# Altium project FLEXI_HAL_2000.PrjPCB (part 2 of 3)

## Sheet Stepper_driver_group.SchDoc: STM32F446 CNC
size C; Author: AM; CompanyName: Expatria Technologies; DrawnBy: A.Marles; Engineer: AM; Organization: Expatria Technologies; DocumentNumber: 4; Revision: A7; SheetNumber: 4; SheetTotal: 14
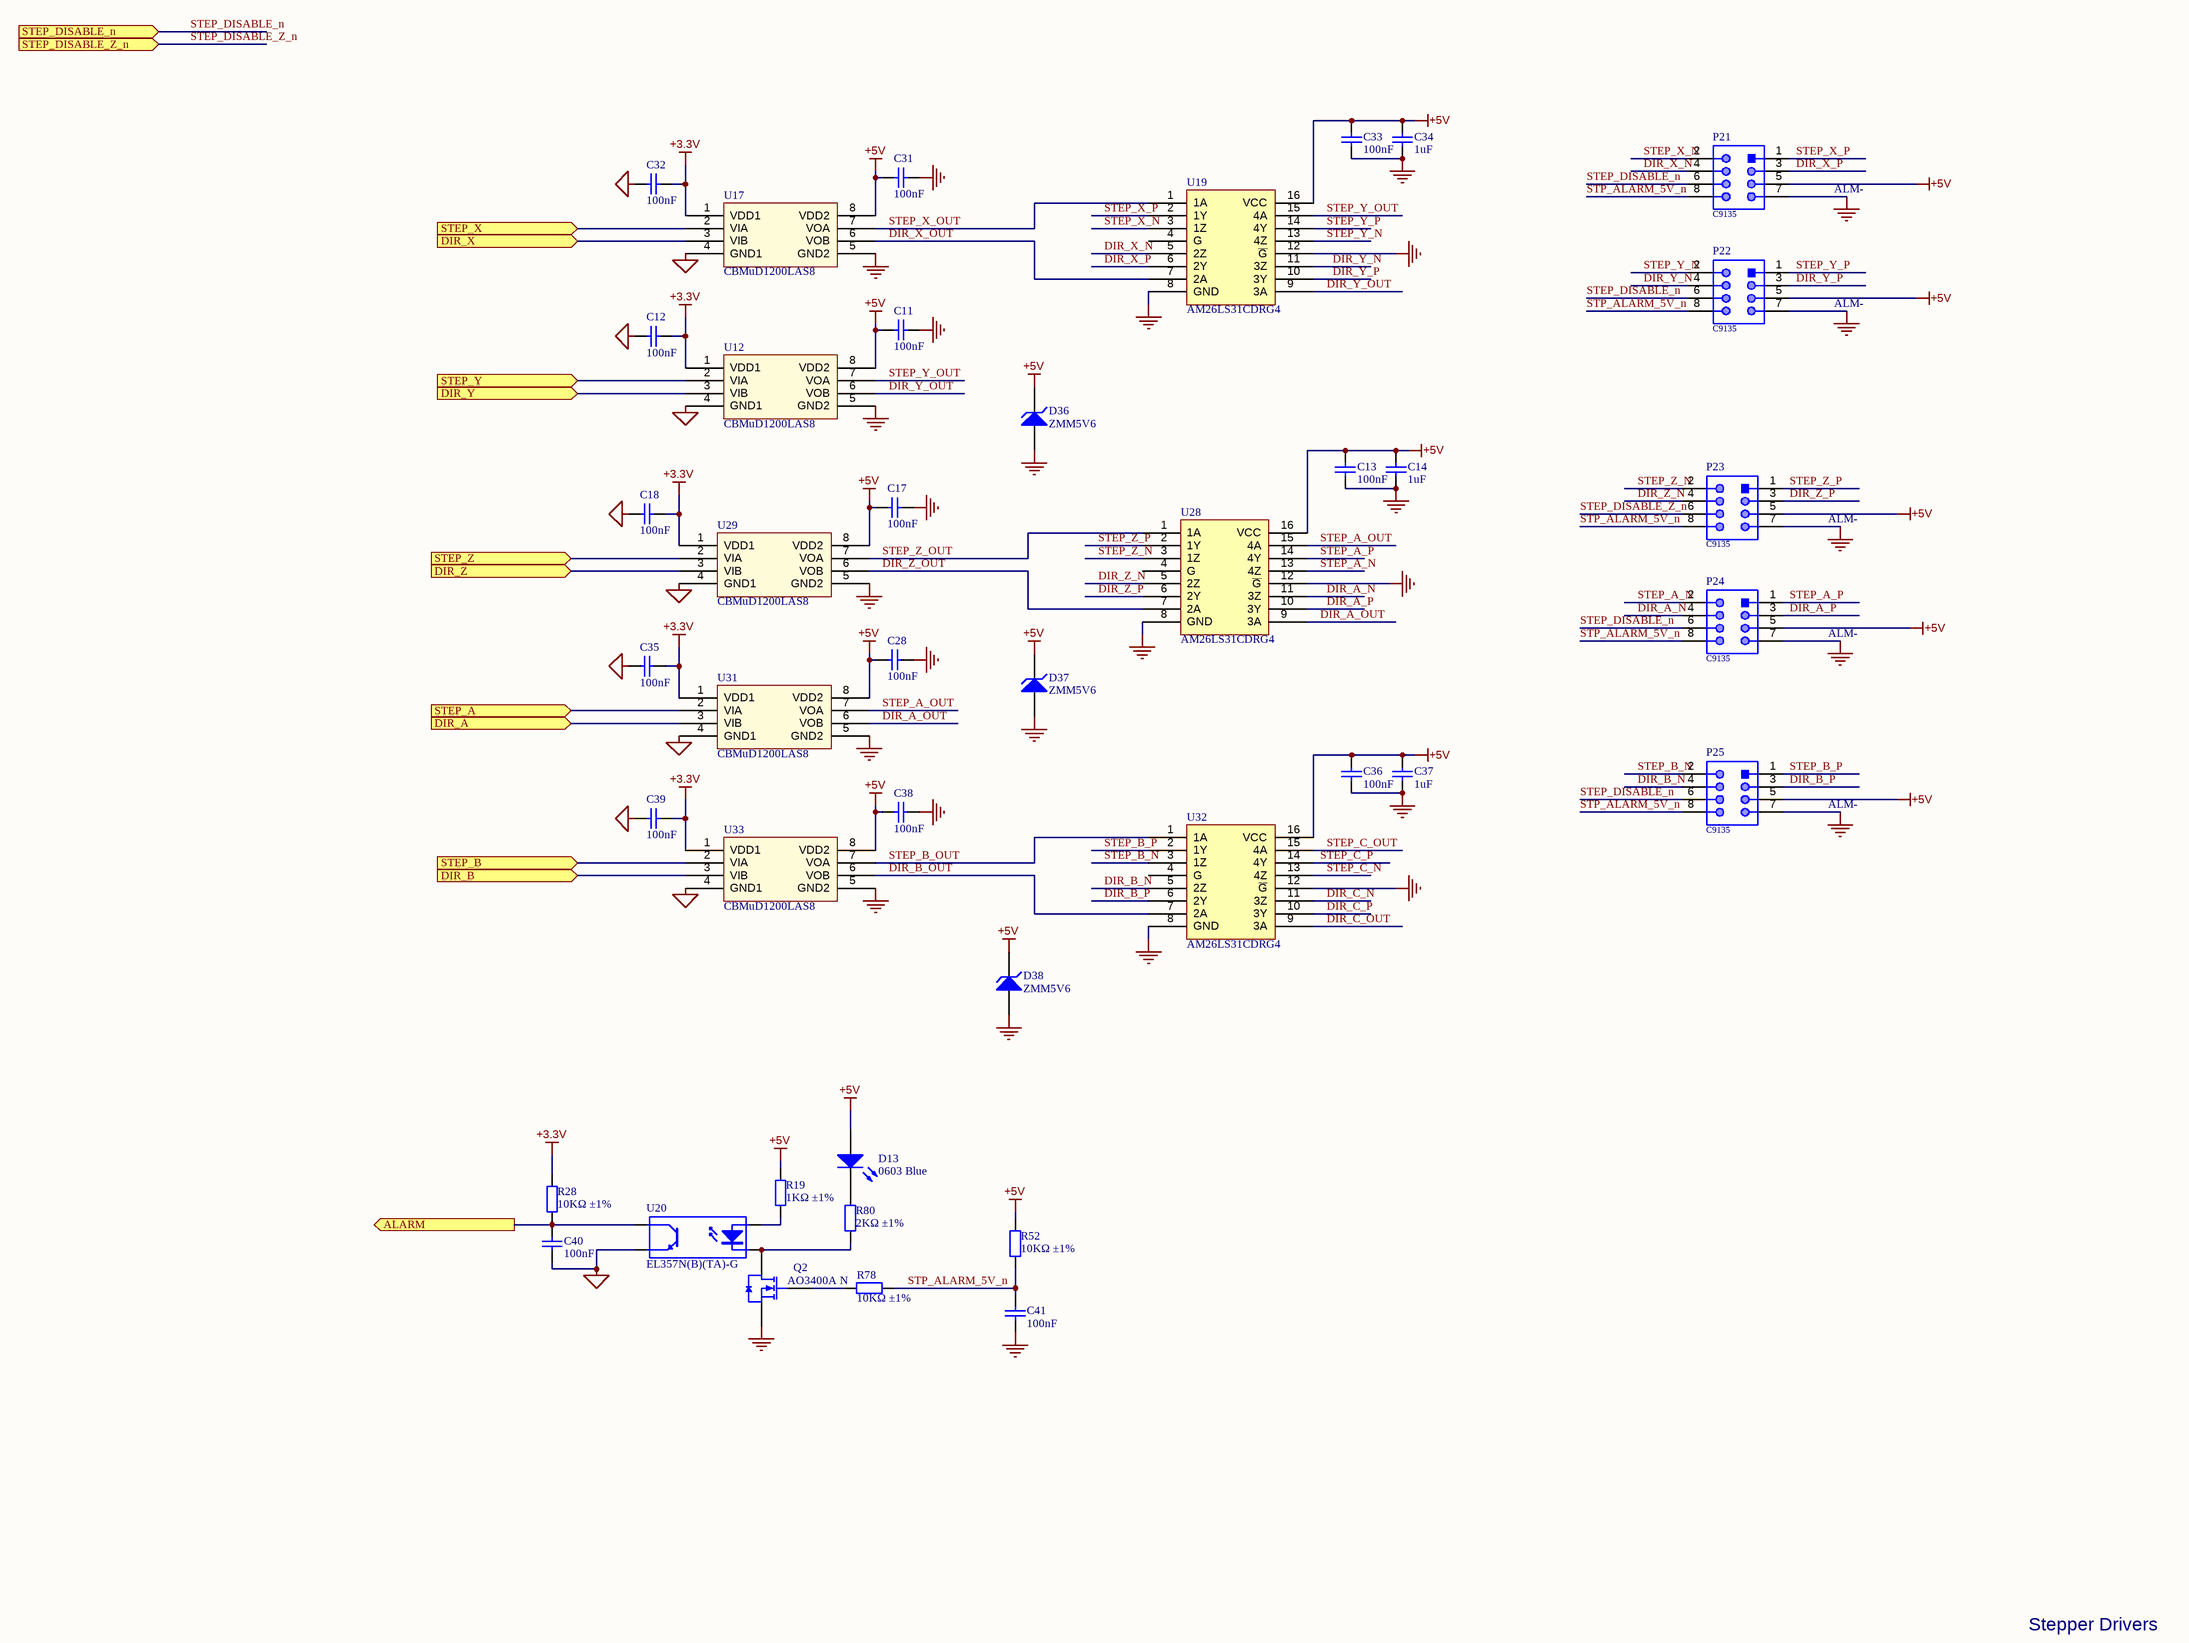
[diagram p7: Stepper_driver_group.SchDoc]

### Parts
C11  100nF  [0603_C]
C12  100nF  [0603_C]
C13  100nF  [0603_C]
C14  1uF  [0603_C]
C17  100nF  [0603_C]
C18  100nF  [0603_C]
C28  100nF  [0603_C]
C31  100nF  [0603_C]
C32  100nF  [0603_C]
C33  100nF  [0603_C]
C34  1uF  [0603_C]
C35  100nF  [0603_C]
C36  100nF  [0603_C]
C37  1uF  [0603_C]
C38  100nF  [0603_C]
C39  100nF  [0603_C]
C40  100nF  [0603_C]
C41  100nF  [0603_C]
D13  0603 Blue  [0603_LED_S1]
D36  ZMM5V6  [LL-34]
D37  ZMM5V6  [LL-34]
D38  ZMM5V6  [LL-34]
P21  C9135  [61200821621]
P22  C9135  [61200821621]
P23  C9135  [61200821621]
P24  C9135  [61200821621]
P25  C9135  [61200821621]
Q2  AO3400A N  [SOT-23-3L]
R19  1KΩ ±1%  [0603_R]
R28  10KΩ ±1%  [0603_R]
R52  10KΩ ±1%  [0603_R]
R78  10KΩ ±1%  [0603_R]
R80  2KΩ ±1%  [0603_R]
U12  CBMuD1200LAS8  [SOIC-8_150mil]
U17  CBMuD1200LAS8  [SOIC-8_150mil]
U19  AM26LS31CDRG4  [SOIC-16_150mil]
U20  EL357N(B)(TA)-G  [SOP-4_P2.54]
U28  AM26LS31CDRG4  [SOIC-16_150mil]
U29  CBMuD1200LAS8  [SOIC-8_150mil]
U31  CBMuD1200LAS8  [SOIC-8_150mil]
U32  AM26LS31CDRG4  [SOIC-16_150mil]
U33  CBMuD1200LAS8  [SOIC-8_150mil]

### Ports
ALARM (out), DIR_A (in), DIR_B (in), DIR_X (in), DIR_Y (in), DIR_Z (in), STEP_A (in), STEP_B (in), STEP_DISABLE_n (in), STEP_DISABLE_Z_n (in), STEP_X (in), STEP_Y (in), STEP_Z (in)

### Nets
+3.3V: C12.1 C18.1 C32.1 C35.1 C39.1 R28.2 U12.1(VDD1) U17.1(VDD1) U29.1(VDD1) U31.1(VDD1) U33.1(VDD1)
+5V: C11.2 C13.1 C14.1 C17.2 C28.2 C31.2 C33.1 C34.1 C36.1 C37.1 C38.2 D13.A D36.2(K) D37.2(K) D38.2(K) P21.5 P22.5 P23.5 P24.5 P25.5 R19.1 R52.2 U12.8(VDD2) U17.8(VDD2) U19.16(VCC) U28.16(VCC) U29.8(VDD2) U31.8(VDD2) U32.16(VCC) U33.8(VDD2)
GND: C11.1 C13.2 C14.2 C17.1 C28.1 C31.1 C33.2 C34.2 C36.2 C37.2 C38.1 C41.1 D36.1(A) D37.1(A) D38.1(A) P21.7 P22.7 P23.7 P24.7 P25.7 Q2.2(S) U12.5(GND2) U17.5(GND2) U19.8(GND) U19.12(~{G}) U28.8(GND) U28.12(~{G}) U29.5(GND2) U31.5(GND2) U32.8(GND) U32.12(~{G}) U33.5(GND2)
MCU_GND: C12.2 C18.2 C32.2 C35.2 C39.2 C40.1 U12.4(GND1) U17.4(GND1) U20.3(E) U29.4(GND1) U31.4(GND1) U33.4(GND1)
DIR_A: U31.3(VIB) ; port DIR_A
DIR_A_N: P24.4 U28.11(3Z)
DIR_A_OUT: U28.9(3A) U31.6(VOB)
DIR_A_P: P24.3 U28.10(3Y)
DIR_B: U33.3(VIB) ; port DIR_B
DIR_B_N: P25.4 U32.5(2Z)
DIR_B_OUT: U32.7(2A) U33.6(VOB)
DIR_B_P: P25.3 U32.6(2Y)
DIR_C_N: U32.11(3Z)
DIR_C_OUT: U32.9(3A)
DIR_C_P: U32.10(3Y)
DIR_X: U17.3(VIB) ; port DIR_X
DIR_X_N: P21.4 U19.5(2Z)
DIR_X_OUT: U17.6(VOB) U19.7(2A)
DIR_X_P: P21.3 U19.6(2Y)
DIR_Y: U12.3(VIB) ; port DIR_Y
DIR_Y_N: P22.4 U19.11(3Z)
DIR_Y_OUT: U12.6(VOB) U19.9(3A)
DIR_Y_P: P22.3 U19.10(3Y)
DIR_Z: U29.3(VIB) ; port DIR_Z
DIR_Z_N: P23.4 U28.5(2Z)
DIR_Z_OUT: U28.7(2A) U29.6(VOB)
DIR_Z_P: P23.3 U28.6(2Y)
STEP_A: U31.2(VIA) ; port STEP_A
STEP_A_N: P24.2 U28.13(4Z)
STEP_A_OUT: U28.15(4A) U31.7(VOA)
STEP_A_P: P24.1 U28.14(4Y)
STEP_B: U33.2(VIA) ; port STEP_B
STEP_B_N: P25.2 U32.3(1Z)
STEP_B_OUT: U32.1(1A) U33.7(VOA)
STEP_B_P: P25.1 U32.2(1Y)
STEP_C_N: U32.13(4Z)
STEP_C_OUT: U32.15(4A)
STEP_C_P: U32.14(4Y)
STEP_DISABLE_n: P21.6 P22.6 P24.6 P25.6 ; port STEP_DISABLE_n
STEP_DISABLE_Z_n: P23.6 ; port STEP_DISABLE_Z_n
STEP_X: U17.2(VIA) ; port STEP_X
STEP_X_N: P21.2 U19.3(1Z)
STEP_X_OUT: U17.7(VOA) U19.1(1A)
STEP_X_P: P21.1 U19.2(1Y)
STEP_Y: U12.2(VIA) ; port STEP_Y
STEP_Y_N: P22.2 U19.13(4Z)
STEP_Y_OUT: U12.7(VOA) U19.15(4A)
STEP_Y_P: P22.1 U19.14(4Y)
STEP_Z: U29.2(VIA) ; port STEP_Z
STEP_Z_N: P23.2 U28.3(1Z)
STEP_Z_OUT: U28.1(1A) U29.7(VOA)
STEP_Z_P: P23.1 U28.2(1Y)
STP_ALARM: C40.2 R28.1 U20.4(C) ; port ALARM
STP_ALARM_5V_n: C41.2 P21.8 P22.8 P23.8 P24.8 P25.8 R52.1 R78.1
NetD13_K: D13.K R80.2
NetQ2_1: Q2.1(G) R78.2
NetQ2_3: Q2.3(D) R80.1 U20.2(K)
NetR19_2: R19.2 U20.1(A)

Not connected (* = marked no-connect by the designer): U19 4(G); U28 4(G); U32 4(G)

### Notes on the sheet
- (near P21) ALM-
- (near P22) ALM-
- (near P23) ALM-
- (near P24) ALM-
- (near P25) ALM-
- Stepper Drivers
- Expatria Technologies
- SHEET
- PROJECT
- REV
- 1136 Glade Court
- Port Coquitlam, BC V3B 1R5
- EMAIL: INFO@EXPATRIA.CA
- SIZE
- ENGR
- C
- MODIFIED
- DOCUMENT
- /
- Copyright Expatria Technologies 2022. This document describes Open Hardware and is licensed under the CERN-OHL-S v2. No warranty is implied or expressed.

### Library data of the parts
C11-C13 C17 C18 C28 C31-C33 C35 C36 C38-C41 = 0603 100nF (104) 10% 50V: as C22 on sheet STM32F446RE_board; ComponentLink1Description: Supplier link; ComponentLink1URL: http://www.szlcsc.com/product/details_15331.html; Package: 0603; Supplier: LC; SuppliersPartNumber: C14663; Capacitance: 100nF
C14 C34 C37 = 0603 1uF (105) 10% 50V: Chip capacitors; Manufacturer: Samsung Electro-Mechanics; PartNumber: CL10A105KB8NNNC; Tolerance: 10%; Voltage: 50V; ComponentLink1Description: Supplier link; ComponentLink1URL: http://www.szlcsc.com/product/details_16531.html; Package: 0603; Supplier: LC; SuppliersPartNumber: C15849; Capacitance: 1uF
D13 = 0603 LED Blue: LED; ComponentLink1Description: 供应商链接; ComponentLink1URL: http://www.szlcsc.com/product/details_73150.html; Package: 0603; Supplier: LC; SuppliersPartNumber: C72041; Color: Blue
D36-D38 = LL-34 ZMM5V6: 500mW - 0.1uA @ 1V 5.6V LL-34 Zener Diodes ROHS; ComponentLink1Description: 供应商链接; ComponentLink1URL: http://www.szlcsc.com/product/details_8541.html; Package: LL-34; Supplier: LC; SuppliersPartNumber: C8062
P21-P25 = CMP-1502-00006-1: Male Box Header WR-BHD, THT, Vertical, pitch 2.54 mm, 8 pins; Manufacturer: Wurth Elektronik; Pitch: 2.54mm; Publisher: WurthElektronik; Part Number: C9135; Packaging: Tray; Published Date: August2018; Package Reference: 61200821621; SuppliersPartNumber: C9135
Q2 = AO3400A N道沟 X0YV1T SOT-23: MOS(场效应管); ComponentLink1Description: 供应商链接; ComponentLink1URL: http://www.szlcsc.com/product/details_21629.html; Package: SOT-23; Supplier: LC; SuppliersPartNumber: C20917
R19 = 0603 1K (1001) 1%: as R6 on sheet Limit_Switches; ComponentLink1Description: Supplier link; ComponentLink1URL: http://www.szlcsc.com/product/details_21904.html; Package: 0603; Supplier: LC; SuppliersPartNumber: C21190; Resistance: 1KΩ; Tolerance: 1%
R28 R52 R78 = 0603 10K (1002) 1%: as R18 on sheet STM32F446RE_board; ComponentLink1Description: Supplier link; ComponentLink1URL: http://www.szlcsc.com/product/details_26547.html; Package: 0603; Supplier: LC; SuppliersPartNumber: C25804; Resistance: 10KΩ; Tolerance: 1%
R80 = 0603 2K (2001) 1%: as R2 on sheet 2xparallelswitch; ComponentLink1Description: Supplier link; ComponentLink1URL: http://www.szlcsc.com/product/details_23702.html; Package: 0603; Supplier: LC; SuppliersPartNumber: C22975; Resistance: 2KΩ; Tolerance: 1%
U12 U17 U29 U31 U33 = CBMuD1200LAS8: Dual Channel Isolator; Package: SOIC-8_150mil; Supplier: LC; SuppliersPartNumber: C476470; ComponentLink1Description: 供应商链接; ComponentLink1URL: http://www.szlcsc.com/product/details_10199.html
U19 U28 U32 = AM26LS31CDRG4_[C6179]: 4/0 Driver - RS422, RS485 16-SOIC; Manufacturer 1: Texas Instruments; ComponentLink1Description: 供应商链接; ComponentLink1URL: http://www.szlcsc.com/product/details_6645.html; Package: SOIC-16_150mil; Supplier: LC; SuppliersPartNumber: C6179; Manufacturer Part Number 1: AM26LS31CDR
U20 = EL357N(B)(TA)-G_[C6649]: OPTOISOLATOR 3.75KV TRANS 4-SOP; Manufacturer 1: Everlight Elec; Package: SOP-4_P2.54; Supplier: LC; SuppliersPartNumber: C6649; Manufacturer Part Number 1: EL357N(B)(TA)-G

## Sheet Spindle_Control.SchDoc: STM32F446 CNC
size B; Author: AM; CompanyName: Expatria Technologies; DrawnBy: A.Marles; Engineer: AM; Organization: Expatria Technolgoies; DocumentNumber: 5; Revision: A7; SheetNumber: 5; SheetTotal: 14
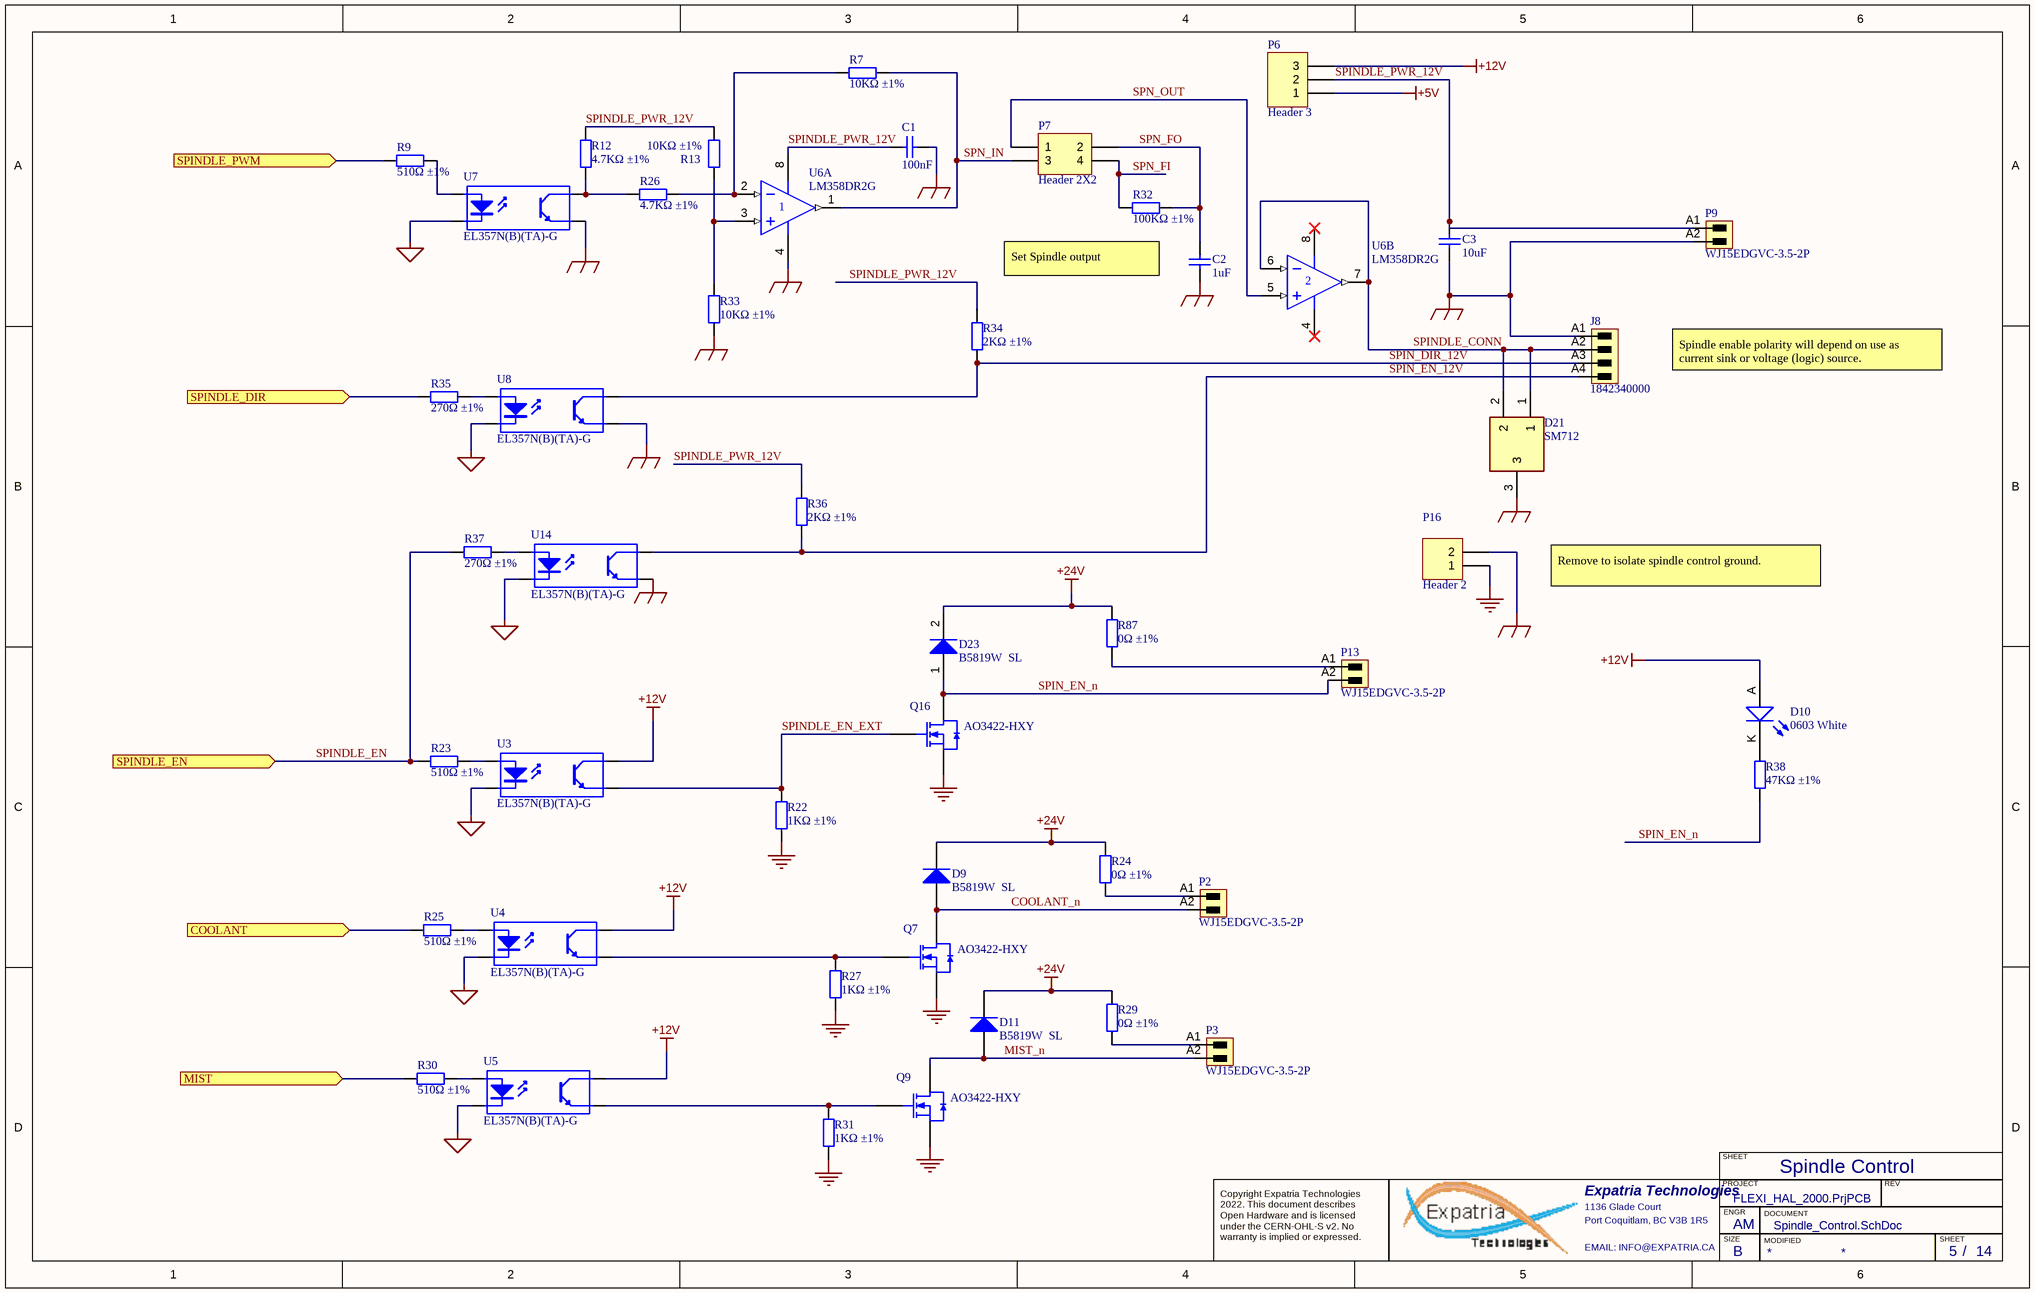
[diagram p8: Spindle_Control.SchDoc]

### Parts
C1  100nF  [0603_C]
C2  1uF  [0603_C]
C3  10uF  [1206_C]
D9  B5819W  SL  [SOD-123]
D10  0603 White  [0603_LED_S1]
D11  B5819W  SL  [SOD-123]
D21  SM712  [SOT95P230X117-3N]
D23  B5819W  SL  [SOD-123]
J8  1842340000  [691321100004]
P2  WJ15EDGVC-3.5-2P  [691321100002]
P3  WJ15EDGVC-3.5-2P  [691321100002]
P6  Header 3  [HDR1X3]
P7  Header 2X2  [HDR2X2]
P9  WJ15EDGVC-3.5-2P  [691321100002]
P13  WJ15EDGVC-3.5-2P  [691321100002]
P16  Header 2  [HDR1X2]
Q7  AO3422-HXY  [SOT-23-3L]
Q9  AO3422-HXY  [SOT-23-3L]
Q16  AO3422-HXY  [SOT-23-3L]
R7  10KΩ ±1%  [0603_R]
R9  510Ω ±1%  [0603_R]
R12  4.7KΩ ±1%  [0603_R]
R13  10KΩ ±1%  [0603_R]
R22  1KΩ ±1%  [0603_R]
R23  510Ω ±1%  [0603_R]
R24  0Ω ±1%  [0603_R]
R25  510Ω ±1%  [0603_R]
R26  4.7KΩ ±1%  [0603_R]
R27  1KΩ ±1%  [0603_R]
R29  0Ω ±1%  [0603_R]
R30  510Ω ±1%  [0603_R]
R31  1KΩ ±1%  [0603_R]
R32  100KΩ ±1%  [0603_R]
R33  10KΩ ±1%  [0603_R]
R34  2KΩ ±1%  [0603_R]
R35  270Ω ±1%  [0603_R]
R36  2KΩ ±1%  [0603_R]
R37  270Ω ±1%  [0603_R]
R38  47KΩ ±1%  [0603_R]
R87  0Ω ±1%  [0603_R]
U3  EL357N(B)(TA)-G  [SOP-4_P2.54]
U4  EL357N(B)(TA)-G  [SOP-4_P2.54]
U5  EL357N(B)(TA)-G  [SOP-4_P2.54]
U6  LM358DR2G  [SOIC-8_150mil]  (parts A,B of 2)
U7  EL357N(B)(TA)-G  [SOP-4_P2.54]
U8  EL357N(B)(TA)-G  [SOP-4_P2.54]
U14  EL357N(B)(TA)-G  [SOP-4_P2.54]

### Ports
COOLANT (in), MIST (in), SPINDLE_DIR (in), SPINDLE_EN (in), SPINDLE_PWM (in)

### Nets
+5V: P6.1
+12V: D10.A P6.3 U3.4(C) U4.4(C) U5.4(C)
+24V: D9.2(K) D11.2(K) D23.2(K) R24.1 R29.1 R87.1
GND: P16.1 Q7.2(S) Q9.2(S) Q16.2(S) R22.1 R27.1 R31.1
MCU_GND: U3.2(K) U4.2(K) U5.2(K) U7.2(K) U8.2(K) U14.2(K)
SPIN_GND: C1.1 C2.1 C3.1 D21.3 J8.A1 P9.A2 P16.2 R33.2 U6.4(V-) U7.3(E) U8.3(E) U14.3(E)
COOLANT: R25.1 ; port COOLANT
COOLANT_n: D9.1(A) P2.A2 Q7.3(D)
MIST: R30.1 ; port MIST
MIST_n: D11.1(A) P3.A2 Q9.3(D)
SPIN_DIR_12V: J8.A3 R34.1 U8.4(C)
SPIN_EN_12V: J8.A4 R36.1 U14.4(C)
SPIN_EN_n: D23.1(A) P13.A2 Q16.3(D) R38.1
SPINDLE_CONN: D21.1 D21.2 J8.A2 U6.6(IN-) U6.7(OUT)
SPINDLE_DIR: R35.1 ; port SPINDLE_DIR
SPINDLE_EN: R23.1 R37.1 ; port SPINDLE_EN
SPINDLE_EN_EXT: Q16.1(G) R22.2 U3.3(E)
SPINDLE_PWM: R9.1 ; port SPINDLE_PWM
SPINDLE_PWR_12V: C1.2 C3.2 P6.2 P9.A1 R12.1 R13.1 R34.2 R36.2 U6.8(V+)
SPN_FI: P7.4 R32.2
SPN_FO: C2.2 P7.2 R32.1
SPN_IN: P7.3 R7.2 U6.1(OUT)
SPN_OUT: P7.1 U6.5(IN+)
NetD10_K: D10.K R38.2
NetP2_A1: P2.A1 R24.2
NetP3_A1: P3.A1 R29.2
NetP13_A1: P13.A1 R87.2
NetQ7_1: Q7.1(G) R27.2 U4.3(E)
NetQ9_1: Q9.1(G) R31.2 U5.3(E)
NetR7_1: R7.1 R26.2 U6.2(IN-)
NetR9_2: R9.2 U7.1(A)
NetR12_2: R12.2 R26.1 U7.4(C)
NetR13_2: R13.2 R33.1 U6.3(IN+)
NetR23_2: R23.2 U3.1(A)
NetR25_2: R25.2 U4.1(A)
NetR30_2: R30.2 U5.1(A)
NetR35_2: R35.2 U8.1(A)
NetR37_2: R37.2 U14.1(A)

### Notes on the sheet
- Set Spindle output
- Spindle enable polarity will depend on use as current sink or voltage (logic) source.
- Remove to isolate spindle control ground.
- Spindle Control
- SHEET
- Expatria Technologies
- 1136 Glade Court
- Port Coquitlam, BC V3B 1R5
- PROJECT
- SIZE
- ENGR
- MODIFIED
- DOCUMENT
- REV
- Copyright Expatria Technologies 2022. This document describes Open Hardware and is licensed under the CERN-OHL-S v2. No warranty is implied or expressed.
- EMAIL: INFO@EXPATRIA.CA
- B
- /

### Library data of the parts
C1 = 0603 100nF (104) 10% 50V: as C22 on sheet STM32F446RE_board; Package: 0603; Supplier: LC; SuppliersPartNumber: C14663; Capacitance: 100nF; Manufacturer 1: YAGEO
C2 = 0603 1uF (105) 10% 50V: as C14 on sheet Stepper_driver_group; Package: 0603; Supplier: LC; SuppliersPartNumber: C15849; Capacitance: 1uF; Manufacturer 1: Samsung Electro-Mechanics
C3 = 1206 10uF (106) 10% 50V: as C24 on sheet STM32F446RE_board; Package: 1206; Supplier: LC; SuppliersPartNumber: C13585; Capacitance: 10uF; Manufacturer 1: Samsung Electro-Mechanics
D9 D11 D23 = SOD-123 B5819W  SL: Schottky Diode; ComponentLink1Description: 供应商链接; ComponentLink1URL: http://www.szlcsc.com/product/details_9093.html; Package: SOD-123; Supplier: LC; SuppliersPartNumber: C8598
D10 = 0603 LED White: LED; ComponentLink1Description: 供应商链接; ComponentLink1URL: http://www.szlcsc.com/product/details_2663.html; Package: 0603; Supplier: LC; SuppliersPartNumber: C2290; Color: White
D21 = CDSOT23-SM712: Bidirectional 12V (Max), 7V (Max) 7.5V / 13.3V 10V / 20V 12A(8/20us) SOT-23-3 TVS RoHS; Manufacturer_Name: DOWO; Height: 1.17mm; Manufacturer_Part_Number: SM712; SuppliersPartNumber: C293966; Manufacturer 1: DOWO; Manufacturer Part Number 1: SM712; Package: SOT-23-3
J8 = 3.5mm Terminal Header 4p: OMNIMATE Signal - series BL/SL 3.50; Revision: V1; SuppliersPartNumber: C880556; ComponentLink1URL: http://www.weidmueller.com/; ComponentLink1Description: Manufacturer URL; Supplier: LCSC
P2 P3 P9 P13 = 3.5mm Terminal Header 2p: Header,Male Pin,Covered(4 Sided) 2 1 0.138"（3.50mm） 2 P=3.5mm Pluggable System Terminal Block RoHS; Manufacturer: Ningbo Kangnex Elec; UL_94_flammability_rating: V-0; Pitch_mm: 3.5 mm; Side_termination_characteristic: closed side; Pitch_inch: 0.138 inch; Solder_pin_length_mm: 3.2 mm; Short_text_for_material: SL 3.50/02/180G 3.2SN OR BX; ComponentLink1Description: Manufacturer URL; ComponentLink1URL: http://www.weidmueller.com/; PartNumber: WJ15EDGVC-3.5-2P; Revision: V1; PackageReference: SL_3_50_180G_02; Packaging: Box; SuppliersPartNumber: C192777; Manufacturer 1: Ningbo Kangnex Elec; Manufacturer Part Number 1: WJ15EDGVC-3.5-2P
P6 = Header 3: Header, 3-Pin; Publisher: Altium Limited; SuppliersPartNumber: C49257
P7 = Header 2X2: Header, 2-Pin, Dual row; Supplier: LC; SuppliersPartNumber: C66690
P16 = Header 2: Header, 2-Pin; Publisher: Altium Limited; LatestRevisionDate: 17-Jul-2002; LatestRevisionNote: Re-released for DXP Platform.; SuppliersPartNumber: C234182
Q7 Q9 Q16 = AO3400A N道沟 X0YV1T SOT-23: 60V 4.5A 8W 75mΩ@10V,5A 2.5V@250uA N Channel 695pF@15V SOT-23-3L MOSFETs ROHS; ComponentLink1Description: 供应商链接; ComponentLink1URL: http://www.szlcsc.com/product/details_21629.html; Package: SOT-23L; Supplier: LC; SuppliersPartNumber: C4748727
R7 R13 R33 = 0603 10K (1002) 1%: as R18 on sheet STM32F446RE_board; Package: 0603; Supplier: LC; SuppliersPartNumber: C25804; Resistance: 10KΩ; Tolerance: 1%; ComponentLink1Description: Supplier link; ComponentLink1URL: http://www.szlcsc.com/product/details_26547.html
R9 R23 R25 R30 = 0603 510R (5100) 1%: Chip resistor; Manufacturer: Uniroyal Elec; PartNumber: 0603WAF5100T5E; Power: 1/10W; Package: 0603; Supplier: LC; SuppliersPartNumber: C23193; Resistance: 510Ω; Tolerance: 1%; ComponentLink1Description: Supplier link; ComponentLink1URL: http://www.szlcsc.com/product/details_23920.html
R12 R26 = 0603 4.7K (4701) 1%: as R86 on sheet STM32F446RE_board; Package: 0603; Supplier: LC; SuppliersPartNumber: C23162; Resistance: 4.7KΩ; Tolerance: 1%; ComponentLink1Description: Supplier link; ComponentLink1URL: http://www.szlcsc.com/product/details_23889.html
R22 R27 R31 = 0603 1K (1001) 1%: as R6 on sheet Limit_Switches; ComponentLink1Description: Supplier link; ComponentLink1URL: http://www.szlcsc.com/product/details_21904.html; Package: 0603; Supplier: LC; SuppliersPartNumber: C21190; Resistance: 1KΩ; Tolerance: 1%
R24 R29 R87 = 0603 0R (0R0) 1%: Chip resistor; Manufacturer: Uniroyal Elec; PartNumber: 0603WAF0000T5E; Power: 1/10W; ComponentLink1Description: Supplier link; ComponentLink1URL: http://www.szlcsc.com/product/details_21903.html; Package: 0603; Supplier: LC; SuppliersPartNumber: C21189; Resistance: 0Ω; Tolerance: 1%
R32 = 0603 100K (1003) 1%: Chip resistor; Manufacturer: Uniroyal Elec; PartNumber: 0603WAF1003T5E; Power: 1/10W; Package: 0603; Supplier: LC; SuppliersPartNumber: C25803; Resistance: 100KΩ; Tolerance: 1%; ComponentLink1Description: Supplier link; ComponentLink1URL: http://www.szlcsc.com/product/details_26546.html
R34 R36 = 0603 2K (2001) 1%: as R2 on sheet 2xparallelswitch; Package: 0603; Supplier: LC; SuppliersPartNumber: C22975; Resistance: 2KΩ; Tolerance: 1%; ComponentLink1Description: Supplier link; ComponentLink1URL: http://www.szlcsc.com/product/details_23702.html
R35 R37 = 0603 270R (2700) 1%: Chip resistor; Manufacturer: Uniroyal Elec; PartNumber: 0603WAF2700T5E; Power: 1/10W; Package: 0603; Supplier: LC; SuppliersPartNumber: C22966; Resistance: 270Ω; Tolerance: 1%; ComponentLink1Description: Supplier link; ComponentLink1URL: http://www.szlcsc.com/product/details_23693.html
R38 = 0603 47K (4702) 1%: as R5 on sheet 2xparallelswitch; ComponentLink1Description: Supplier link; ComponentLink1URL: http://www.szlcsc.com/product/details_26562.html; Package: 0603; Supplier: LC; SuppliersPartNumber: C25819; Resistance: 47KΩ; Tolerance: 1%
U3-U5 U7 U8 U14 = EL357N(B)(TA)-G_[C6649]: as U20 on sheet Stepper_driver_group; Package: SOP-4_P2.54; Supplier: LC; SuppliersPartNumber: C6649; Manufacturer Part Number 1: EL357N(B)(TA)-G
  U3-U5: ComponentLink1Description: 供应商链接; ComponentLink1URL: http://www.szlcsc.com/product/details_7114.html
U6 = LM358DR2G_[C7950]: Dual Op Amp,  5 - 28 V,  8-PinSOIC; Manufacturer 1: ON Semiconductor; Package: SOIC-8; Supplier: LC; SuppliersPartNumber: C7950; Manufacturer Part Number 1: LM358DR2G; Packaging: Tape and Reel; Length: 5mm

## Sheet I2C_Keypad.SchDoc: STM32F446 CNC
size B; Author: AM; CompanyName: Expatria Technologies; DrawnBy: A.Marles; Engineer: AM; Organization: Expatria Technolgoies; DocumentNumber: 12; Revision: A7; SheetNumber: 12; SheetTotal: 14
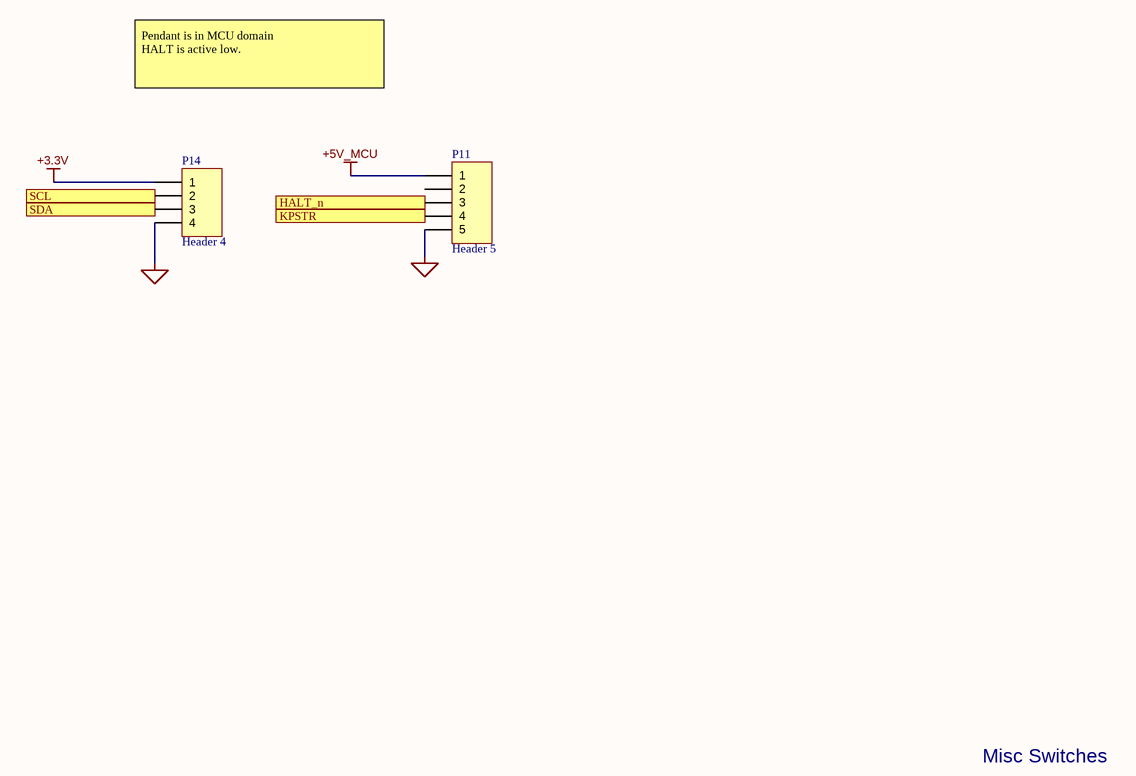
[diagram p9: I2C_Keypad.SchDoc]

### Parts
P11  Header 5  [HDR1X5]
P14  Header 4  [HDR1X4]

### Ports
HALT_n (out), KPSTR (out), SCL (in), SDA (in)

### Nets
+3.3V: P14.1
+5V_MCU: P11.1
MCU_GND: P11.5 P14.4
HALT_n: P11.3 ; port HALT_n
KPSTR: P11.4 ; port KPSTR
SCL: P14.2 ; port SCL
SDA: P14.3 ; port SDA

Not connected (* = marked no-connect by the designer): P11 2

### Notes on the sheet
- Pendant is in MCU domain
  HALT is active low.
- Misc Switches
- SHEET
- Expatria Technologies
- 1136 Glade Court
- Port Coquitlam, BC V3B 1R5
- PROJECT
- SIZE
- ENGR
- MODIFIED
- DOCUMENT
- REV
- Copyright Expatria Technologies 2022. This document describes Open Hardware and is licensed under the CERN-OHL-S v2. No warranty is implied or expressed.
- EMAIL: INFO@EXPATRIA.CA
- B
- /

### Library data of the parts
P11 = Header 5: Header, 5-Pin; LatestRevisionDate: 17-Jul-2002; LatestRevisionNote: Re-released for DXP Platform.; Publisher: Altium Limited; SuppliersPartNumber: C124379
P14 = Header 4: Header, 4-Pin; Publisher: Altium Limited; SuppliersPartNumber: C124378

## Sheet RS485.SchDoc: RP2040 CNC
size B; Author: AM; CompanyName: Expatria Technologies; DrawnBy: A.Marles; Engineer: AM; Organization: Expatria Technolgoies; DocumentNumber: 6; Revision: A7; SheetNumber: 6; SheetTotal: 14
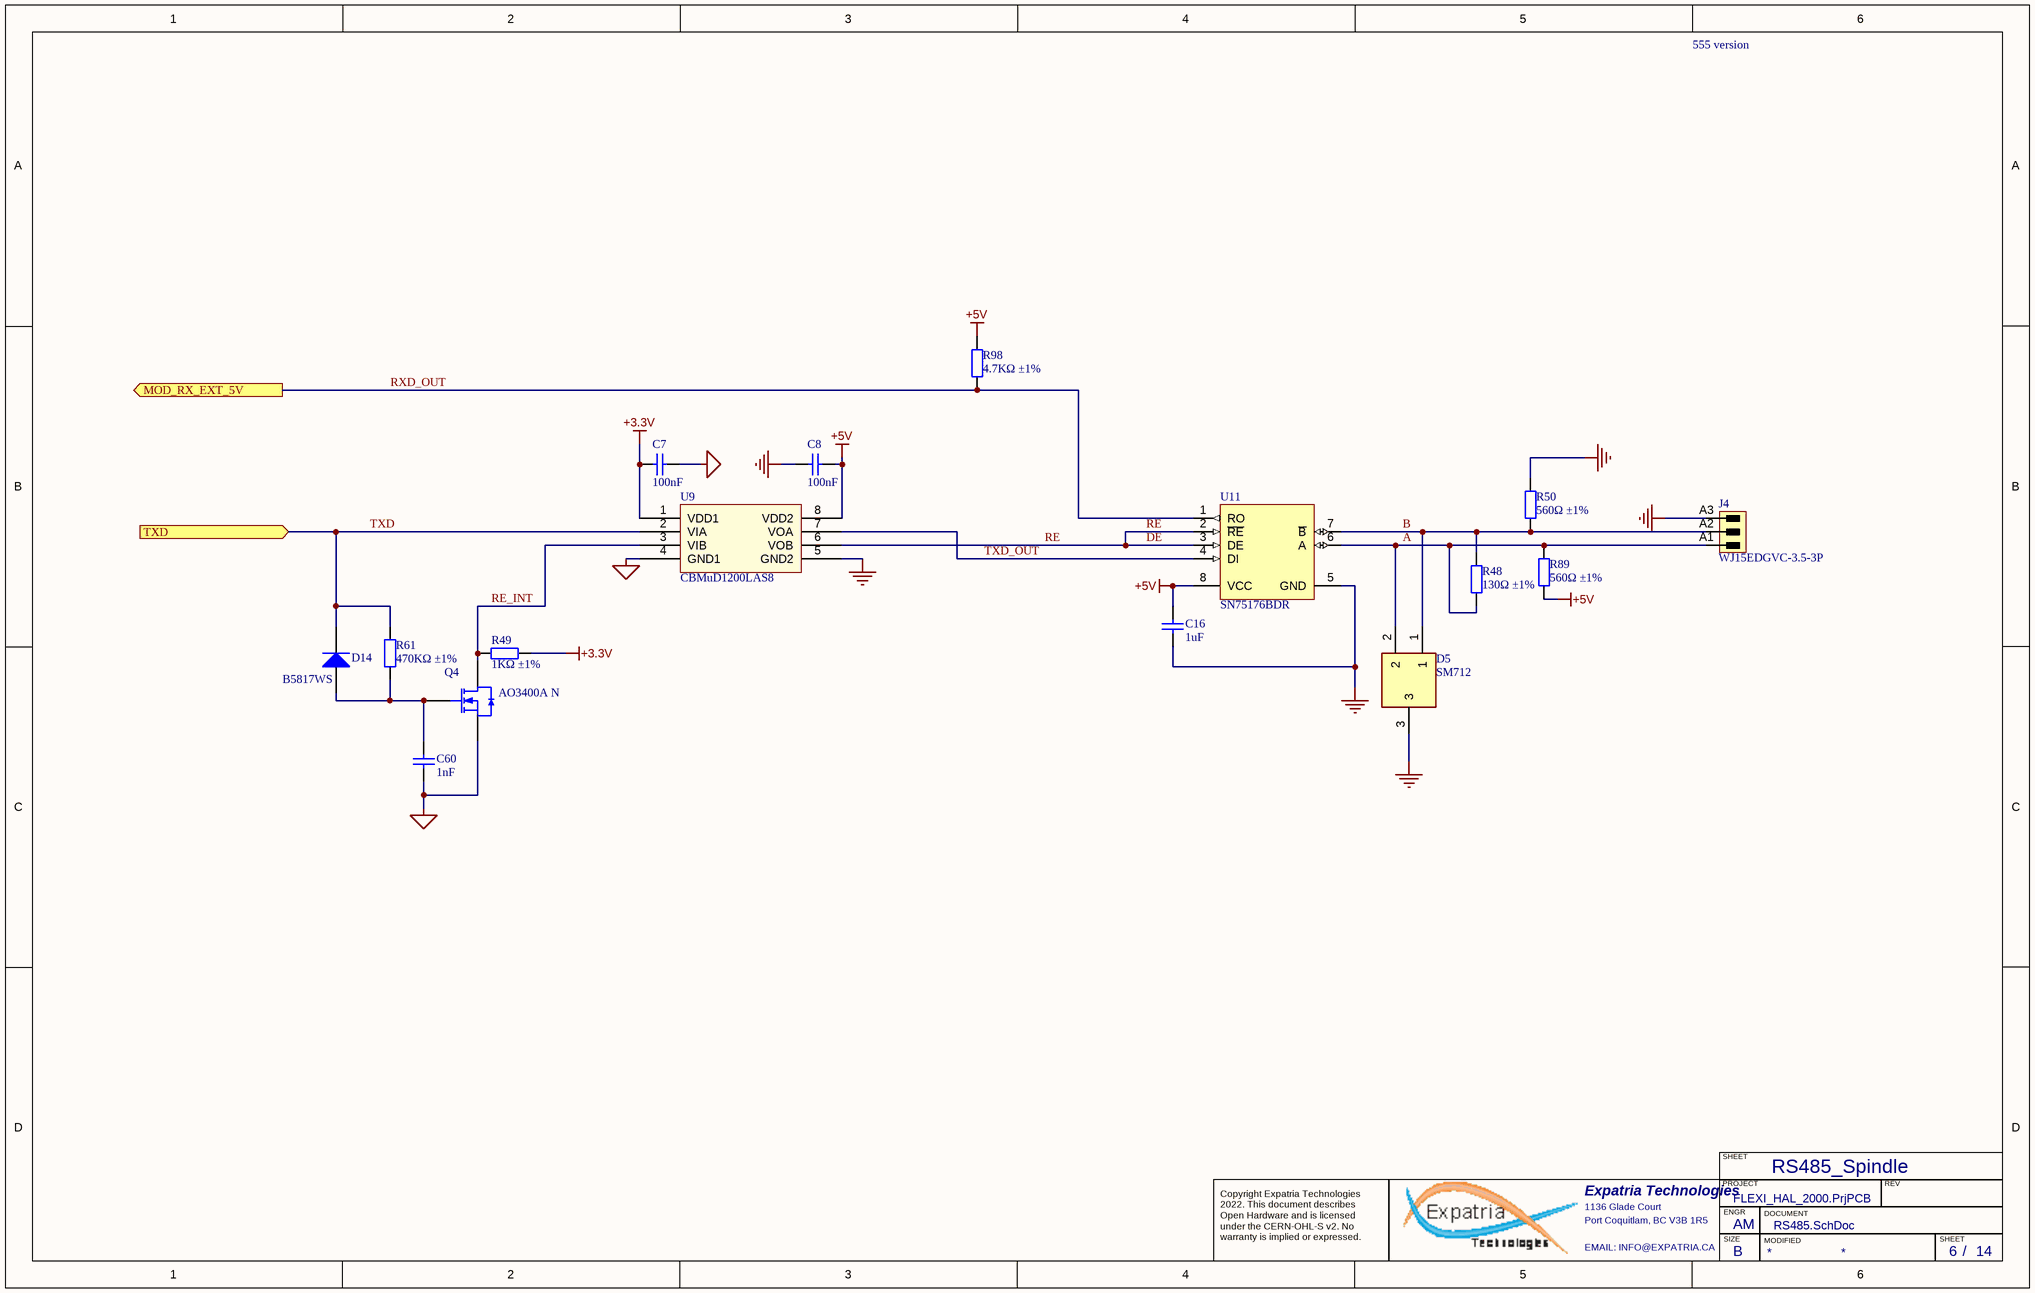
[diagram p10: RS485.SchDoc]

### Parts
C7  100nF  [0603_C]
C8  100nF  [0603_C]
C16  1uF  [0603_C]
C60  1nF  [0603_C]
D5  SM712  [SOT95P230X117-3N]
D14  B5817WS  [SOD-323]
J4  WJ15EDGVC-3.5-3P  [691321100003 - 3.5mm  3p]
Q4  AO3400A N  [SOT-23-3L]
R48  130Ω ±1%  [0603_R]
R49  1KΩ ±1%  [0603_R]
R50  560Ω ±1%  [0603_R]
R61  470KΩ ±1%  [0603_R]
R89  560Ω ±1%  [0603_R]
R98  4.7KΩ ±1%  [0603_R]
U9  CBMuD1200LAS8  [SOIC-8_150mil]
U11  SN75176BDR  [SOIC-8_150mil]

### Ports
MOD_RX_EXT_5V (out), TXD (in)

### Nets
+3.3V: C7.1 R49.1 U9.1(VDD1)
+5V: C8.2 C16.2 R89.2 R98.2 U9.8(VDD2) U11.8(VCC)
GND: C8.1 C16.1 D5.3 J4.A3 R50.1 U9.5(GND2) U11.5(GND)
MCU_GND: C7.2 C60.2 Q4.2(S) U9.4(GND1)
A: D5.2 J4.A1 R48.1 R89.1 U11.6(A)
B: D5.1 J4.A2 R48.2 R50.2 U11.7(~{B})
DE: U9.6(VOB) U11.2(~{RE}) U11.3(DE)  [also labelled RE]
RE_INT: Q4.3(D) R49.2 U9.3(VIB)
RXD_OUT: R98.1 U11.1(RO) ; port MOD_RX_EXT_5V
TXD: D14.2(K) R61.1 U9.2(VIA) ; port TXD  [project net TXD_EXT]
TXD_OUT: U9.7(VOA) U11.4(DI)
NetC60_1: C60.1 D14.1(A) Q4.1(G) R61.2

### Notes on the sheet
- 555 version
- RS485_Spindle
- SHEET
- Expatria Technologies
- 1136 Glade Court
- Port Coquitlam, BC V3B 1R5
- PROJECT
- SIZE
- ENGR
- MODIFIED
- DOCUMENT
- REV
- Copyright Expatria Technologies 2022. This document describes Open Hardware and is licensed under the CERN-OHL-S v2. No warranty is implied or expressed.
- EMAIL: INFO@EXPATRIA.CA
- B
- /

### Library data of the parts
C7 C8 = 0603 100nF (104) 10% 50V: as C22 on sheet STM32F446RE_board; ComponentLink1Description: Supplier link; ComponentLink1URL: http://www.szlcsc.com/product/details_15331.html; Package: 0603; Supplier: LC; SuppliersPartNumber: C14663; Capacitance: 100nF
C16 = 0603 1uF (105) 10% 50V: as C14 on sheet Stepper_driver_group; ComponentLink1Description: Supplier link; ComponentLink1URL: http://www.szlcsc.com/product/details_16531.html; Package: 0603; Supplier: LC; SuppliersPartNumber: C15849; Capacitance: 1uF
C60 = 0603 1nF (102) 10% 50V: Chip capacitors; Manufacturer: Samsung Electro-Mechanics; PartNumber: CL10B102KB8NNNC; Tolerance: 10%; Voltage: 50V; ComponentLink1Description: Supplier link; ComponentLink1URL: http://www.szlcsc.com/product/details_1940.html; Package: 0603; Supplier: LC; SuppliersPartNumber: C1588; Capacitance: 1nF
D5 = CDSOT23-SM712: as D21 on sheet Spindle_Control; Height: 1.17mm; Manufacturer_Part_Number: SM712; SuppliersPartNumber: C293966
D14 = SOD-123 B5819W  SL: 20V 750mV@3A 1A SOD-323 Schottky Barrier Diodes (SBD) ROHS; Package: SOD-323; Supplier: LC; SuppliersPartNumber: C699102
J4 = 3.5mm Terminal Header 3p: Header,Male Pin,Covered(4 Sided) 3 1 0.138"（3.50mm） 3 P=3.5mm Pluggable System Terminal Block RoHS; Manufacturer: Ningbo Kangnex Elec; Pitch_mm: 3.5 mm; UL_94_flammability_rating: V-0; Side_termination_characteristic: closed side; Solder_pin_length_mm: 3.2 mm; Short_text_for_material: SL 3.50/03/180G 3.2SN OR BX; Pitch_inch: 0.138 inch; PartNumber: WJ15EDGVC-3.5-3P; PackageReference: SL_3_50_180G_03; ComponentLink1URL: http://www.weidmueller.com/; ComponentLink1Description: Manufacturer URL; Packaging: Box; Revision: V1; SuppliersPartNumber: C192778; Manufacturer 1: Ningbo Kangnex Elec; Manufacturer Part Number 1: WJ15EDGVC-3.5-3P; Package: P=3.5mm
Q4 = AO3400A N道沟 X0YV1T SOT-23: MOS(场效应管); ComponentLink1Description: 供应商链接; ComponentLink1URL: http://www.szlcsc.com/product/details_21629.html; Package: SOT-23; Supplier: LC; SuppliersPartNumber: C20917
R48 = 0603 130R (1300) 1%: Chip resistor; Manufacturer: Uniroyal Elec; PartNumber: 0603WAF1300T5E; Power: 1/10W; ComponentLink1Description: Supplier link; ComponentLink1URL: http://www.szlcsc.com/product/details_23523.html; Package: 0603; Supplier: LC; SuppliersPartNumber: C22796; Resistance: 130Ω; Tolerance: 1%
R49 = 0603 1K (1001) 1%: as R6 on sheet Limit_Switches; ComponentLink1Description: Supplier link; ComponentLink1URL: http://www.szlcsc.com/product/details_21904.html; Package: 0603; Supplier: LC; SuppliersPartNumber: C21190; Resistance: 1KΩ; Tolerance: 1%
R50 R89 = 0603 560R (5600) 1%: Chip resistor; Manufacturer: Uniroyal Elec; PartNumber: 0603WAF5600T5E; Power: 1/10W; ComponentLink1Description: Supplier link; ComponentLink1URL: http://www.szlcsc.com/product/details_23931.html; Package: 0603; Supplier: LC; SuppliersPartNumber: C23204; Resistance: 560Ω; Tolerance: 1%
R61 = 0603 470K (4703) 1%: Chip resistor; Manufacturer: Uniroyal Elec; PartNumber: 0603WAF4703T5E; Power: 1/10W; ComponentLink1Description: Supplier link; ComponentLink1URL: http://www.szlcsc.com/product/details_23905.html; Package: 0603; Supplier: LC; SuppliersPartNumber: C23178; Resistance: 470KΩ; Tolerance: 1%
R98 = 0603 4.7K (4701) 1%: as R86 on sheet STM32F446RE_board; ComponentLink1Description: Supplier link; ComponentLink1URL: http://www.szlcsc.com/product/details_23889.html; Package: 0603; Supplier: LC; SuppliersPartNumber: C23162; Resistance: 4.7KΩ; Tolerance: 1%
U9 = CBMuD1200LAS8: Dual Channel Isolator; Package: SOIC-8_150mil; Supplier: LC; SuppliersPartNumber: C476470; ComponentLink1Description: 供应商链接; ComponentLink1URL: http://www.szlcsc.com/product/details_10199.html
U11 = SN75176BDR_[C7063]: RS-485/RS-422; ComponentLink1Description: 供应商链接; ComponentLink1URL: http://www.szlcsc.com/product/details_7535.html; Package: SOIC-8_150mil; Supplier: LC; SuppliersPartNumber: C7063

## Sheet MCU_STM32F446RE.SchDoc: STM32F446 CNC
size B; Author: AM; CompanyName: Expatria Technologies; DrawnBy: A.Marles; Engineer: AM; Organization: Expatria Technologies; DocumentNumber: 3; Revision: A7; SheetNumber: 3; SheetTotal: 14
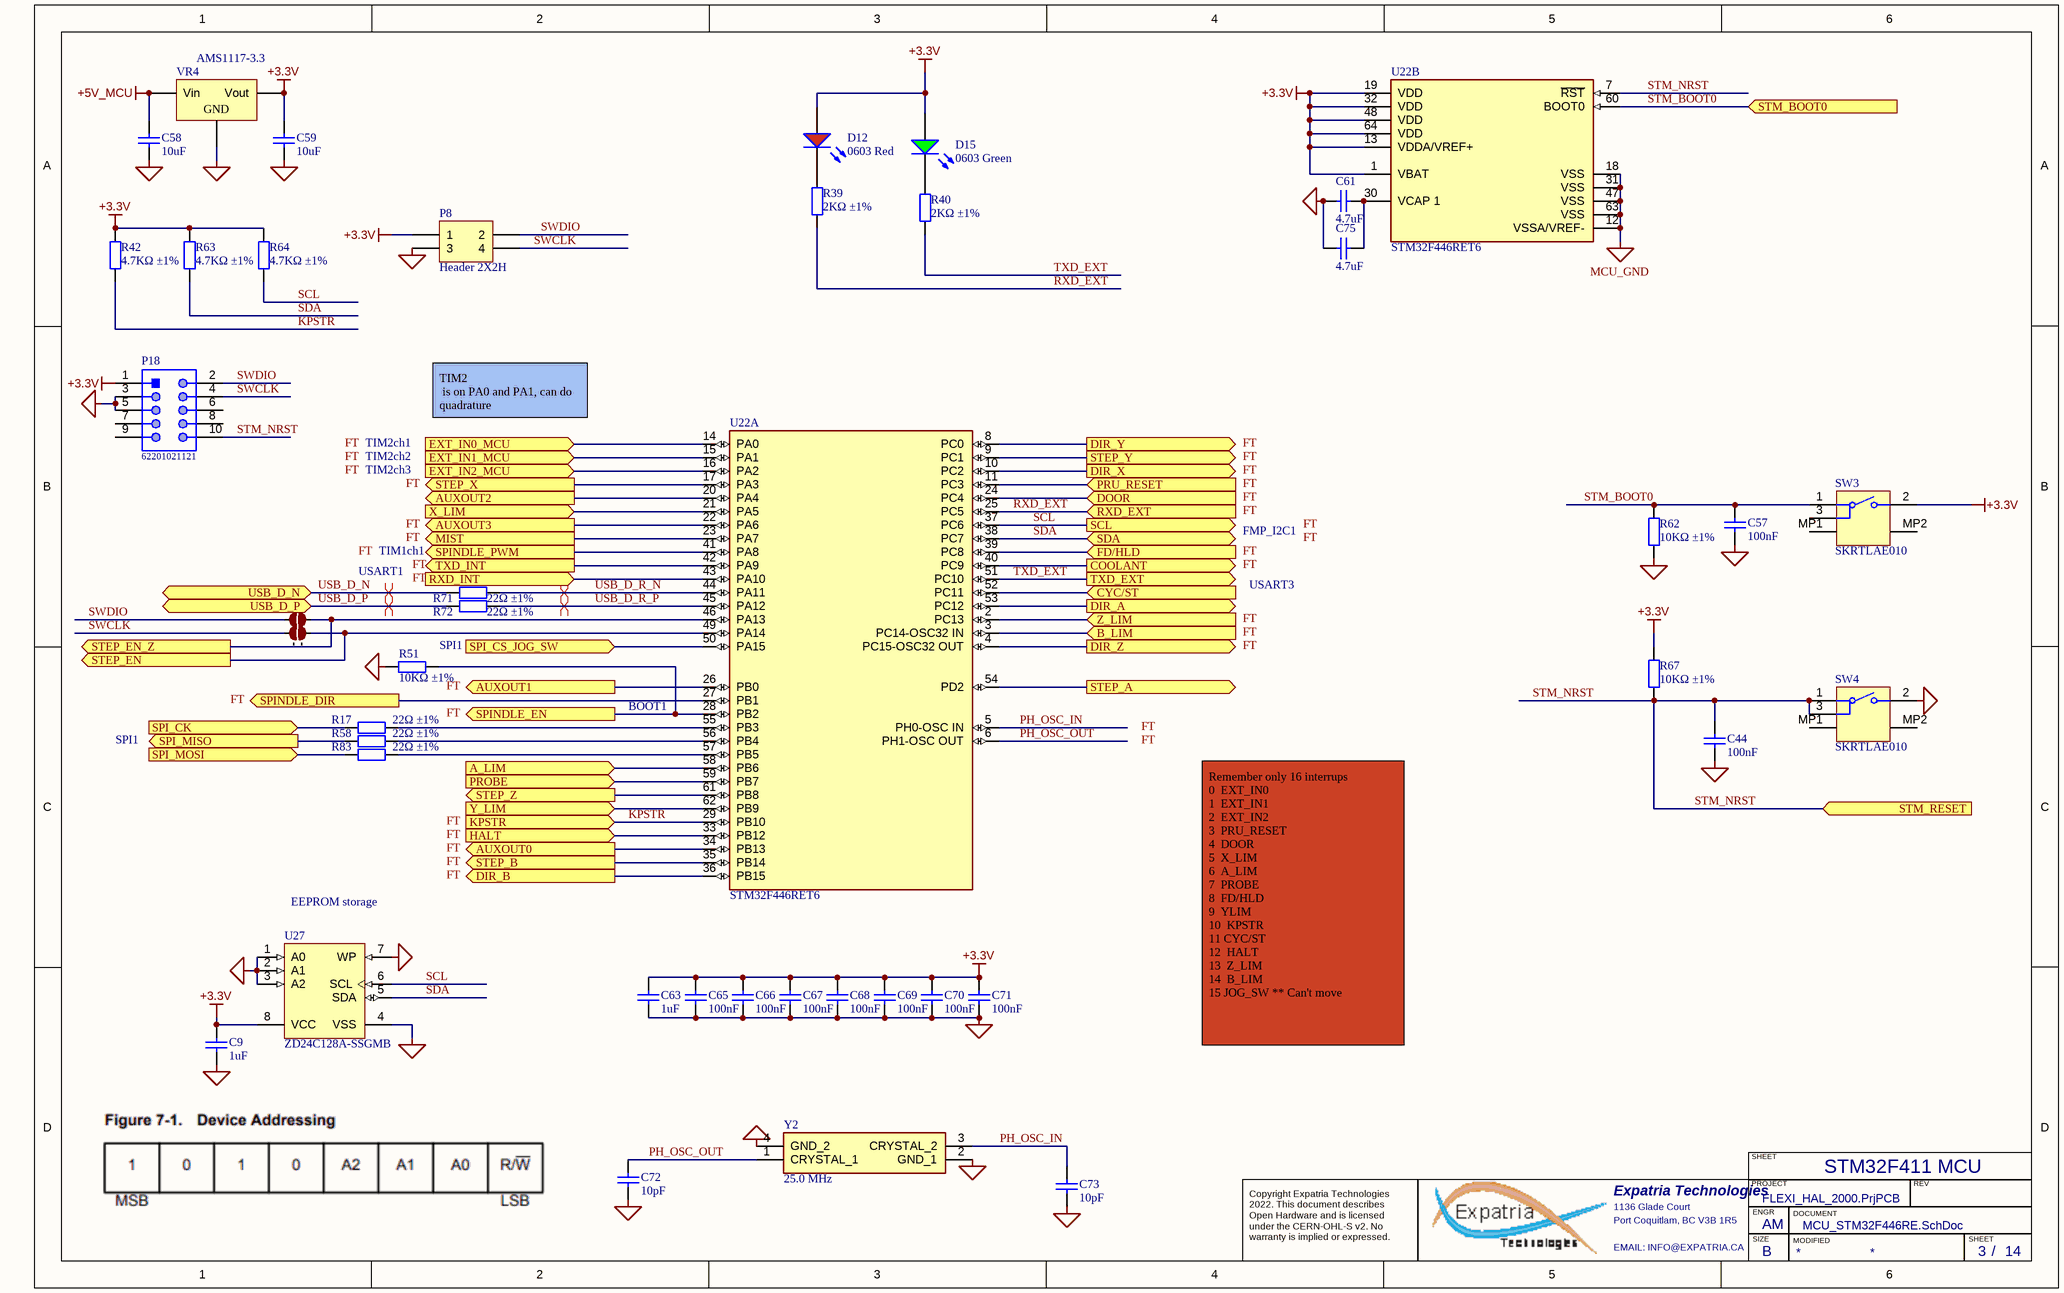
[diagram p11: MCU_STM32F446RE.SchDoc]

### Parts
C9  1uF  [0603_C]
C44  100nF  [0603_C]
C57  100nF  [0603_C]
C58  10uF  [1206_C]
C59  10uF  [1206_C]
C61  4.7uF  [0603_C]
C63  1uF  [0603_C]
C65  100nF  [0603_C]
C66  100nF  [0603_C]
C67  100nF  [0603_C]
C68  100nF  [0603_C]
C69  100nF  [0603_C]
C70  100nF  [0603_C]
C71  100nF  [0603_C]
C72  10pF  [0603_C]
C73  10pF  [0603_C]
C75  4.7uF  [0603_C]
D12  0603 Red  [0603_LED_S1]
D15  0603 Green  [0603_LED_S1]
J10  2 way net solder junction - Normally Open  [2waySolder_NO]  (value not drawn)  (no BOM)
J11  2 way net solder junction - Normally Open  [2waySolder_NO]  (value not drawn)  (no BOM)
P8  Header 2X2H  [HDR2X2H]  (no BOM)
P18  62201021121  [62201021121]  (no BOM)
R17  22Ω ±1%  [0603_R]
R39  2KΩ ±1%  [0603_R]
R40  2KΩ ±1%  [0603_R]
R42  4.7KΩ ±1%  [0603_R]
R51  10KΩ ±1%  [0603_R]
R58  22Ω ±1%  [0603_R]
R62  10KΩ ±1%  [0603_R]
R63  4.7KΩ ±1%  [0603_R]
R64  4.7KΩ ±1%  [0603_R]
R67  10KΩ ±1%  [0603_R]
R71  22Ω ±1%  [0603_R]
R72  22Ω ±1%  [0603_R]
R83  22Ω ±1%  [0603_R]
SW3  SKRTLAE010  [ALPS-SKRTLAE010_V]
SW4  SKRTLAE010  [ALPS-SKRTLAE010_V]
U22  STM32F446RET6  [FP-LQFP64-5W-IPC_B]  (parts A,B of 2)
U27  ZD24C128A-SSGMB  [SOIC-SN8_L]
VR4  AMS1117-3.3  [SOT-223]
Y2  25.0 MHz  [YSX321SL]

### Ports
A_LIM (in), AUXOUT0 (out), AUXOUT1 (out), AUXOUT2 (out), AUXOUT3 (out), B_LIM (in), COOLANT (out), CYC/ST (in), DIR_A (out), DIR_B (out), DIR_X (out), DIR_Y (out), DIR_Z (out), DOOR (in), EXT_IN0_MCU (in), EXT_IN1_MCU (in), EXT_IN2_MCU (in), FD/HLD (in), HALT (in), KPSTR (in), MIST (out), PROBE (in), PRU_RESET (in), RXD_EXT (in), RXD_INT (in), SCL (out), SDA (bidir), SPI_CK (in), SPI_CS_JOG_SW (in), SPI_MISO (out), SPI_MOSI (in), SPINDLE_DIR (out), SPINDLE_EN (out), SPINDLE_PWM (out), STEP_A (out), STEP_B (out), STEP_EN (out), STEP_EN_Z (out), STEP_X (out), STEP_Y (out), STEP_Z (out), STM_BOOT0 (in), STM_RESET (in), TXD_EXT (out), TXD_INT (out), USB_D_N (bidir), USB_D_P (bidir), X_LIM (in), Y_LIM (in), Z_LIM (in)

### Nets
+3.3V: C9.2 C59.2 C63.2 C65.2 C66.2 C67.2 C68.2 C69.2 C70.2 C71.2 D12.A D15.A P8.1 P18.1 R42.2 R63.2 R64.2 R67.1 SW3.2 U22.1(VBAT) U22.13(VDDA/VREF+) U22.19(VDD) U22.32(VDD) U22.48(VDD) U22.64(VDD) U27.8(VCC) VR4.2(Vout)
+5V_MCU: C58.2 VR4.3(Vin)
MCU_GND: C9.1 C44.1 C57.1 C58.1 C59.1 C61.1 C63.1 C65.1 C66.1 C67.1 C68.1 C69.1 C70.1 C71.1 C72.1 C73.1 C75.1 P8.3 P18.3 P18.5 R51.1 R62.2 SW4.2 U22.12(VSSA/VREF-) U22.18(VSS) U22.31(VSS) U22.47(VSS) U22.63(VSS) U27.1(A0) U27.2(A1) U27.3(A2) U27.4(VSS) U27.7(WP) VR4.1(GND) Y2.2(GND_1) Y2.4(GND_2)
A_LIM: U22.58(PB6) ; port A_LIM
AUXOUT_0: U22.34(PB13) ; port AUXOUT0
AUXOUT_1: U22.26(PB0) ; port AUXOUT1
AUXOUT_2: U22.20(PA4) ; port AUXOUT2
AUXOUT_3: U22.22(PA6) ; port AUXOUT3
B_LIM: U22.3(PC14-OSC32_IN) ; port B_LIM
COOLANT: U22.40(PC9) ; port COOLANT
CYC/ST: U22.52(PC11) ; port CYC/ST
DIR_A: U22.53(PC12) ; port DIR_A
DIR_B: U22.36(PB15) ; port DIR_B
DIR_X: U22.10(PC2) ; port DIR_X
DIR_Y: U22.8(PC0) ; port DIR_Y
DIR_Z: U22.4(PC15-OSC32_OUT) ; port DIR_Z
DOOR: U22.24(PC4) ; port DOOR
EXT_IN0_BUF: U22.14(PA0) ; port EXT_IN0_MCU
EXT_IN1_BUF: U22.15(PA1) ; port EXT_IN1_MCU
EXT_IN2_BUF: U22.16(PA2) ; port EXT_IN2_MCU
FD/HLD: U22.39(PC8) ; port FD/HLD
HALT_n: U22.33(PB12) ; port HALT
KPSTR: R42.1 U22.29(PB10) ; port KPSTR
MIST: U22.23(PA7) ; port MIST
PH_OSC_IN: C73.2 U22.5(PH0-OSC_IN) Y2.3(CRYSTAL_2)
PH_OSC_OUT: C72.2 U22.6(PH1-OSC_OUT) Y2.1(CRYSTAL_1)
PROBE: U22.59(PB7) ; port PROBE
PRU_RESET: U22.11(PC3) ; port PRU_RESET
RXD_EXT: R39.1 U22.25(PC5) ; port RXD_EXT
RXD_INT: U22.43(PA10) ; port RXD_INT
SCL: R64.1 U22.37(PC6) U27.6(SCL) ; port SCL
SDA: R63.1 U22.38(PC7) U27.5(SDA) ; port SDA
SPI_CLK: R17.2 ; port SPI_CK
SPI_CS_JOG_SW: U22.50(PA15) ; port SPI_CS_JOG_SW
SPI_MISO: R58.2 ; port SPI_MISO
SPI_MOSI: R83.2 ; port SPI_MOSI
SPINDLE_DIR: U22.27(PB1) ; port SPINDLE_DIR
SPINDLE_EN: R51.2 U22.28(PB2) ; port SPINDLE_EN
SPINDLE_PWM: U22.41(PA8) ; port SPINDLE_PWM
STEP_A: U22.54(PD2) ; port STEP_A
STEP_B: U22.35(PB14) ; port STEP_B
STEP_EN: J11.2 U22.49(PA14) ; port STEP_EN
STEP_EN_Z: J10.2 U22.46(PA13) ; port STEP_EN_Z
STEP_X: U22.17(PA3) ; port STEP_X
STEP_Y: U22.9(PC1) ; port STEP_Y
STEP_Z: U22.61(PB8) ; port STEP_Z
STM_BOOT0: C57.2 R62.1 SW3.1 U22.60(BOOT0) ; port STM_BOOT0
STM_NRST: C44.2 P18.10 R67.2 SW4.1 SW4.3 U22.7(~{RST}) ; port STM_RESET  [project net STM_RESET]
SWCLK: J11.1 P8.4 P18.4
SWDIO: J10.1 P8.2 P18.2
TXD_EXT: R40.1 U22.51(PC10) ; port TXD_EXT
TXD_INT: U22.42(PA9) ; port TXD_INT
USB_D_N: R71.2 ; port USB_D_N
USB_D_P: R72.2 ; port USB_D_P
USB_D_R_N: R71.1 U22.44(PA11)
USB_D_R_P: R72.1 U22.45(PA12)
X_LIM: U22.21(PA5) ; port X_LIM
Y_LIM: U22.62(PB9) ; port Y_LIM
Z_LIM: U22.2(PC13) ; port Z_LIM
NetC61_2: C61.2 C75.2 U22.30(VCAP_1)
NetD12_K: D12.K R39.2
NetD15_K: D15.K R40.2
NetR17_1: R17.1 U22.55(PB3)
NetR58_1: R58.1 U22.56(PB4)
NetR83_1: R83.1 U22.57(PB5)

Not connected (* = marked no-connect by the designer): P18 6 7 8 9; SW3 3 MP1 MP2; SW4 MP1 MP2

### Layout directives
differential pair: USB_D_N, USB_D_P, USB_D_R_N, USB_D_R_P

### Notes on the sheet
- TIM2
  is on PA0 and PA1, can do quadrature
- FT
- TIM2ch1
- TIM2ch2
- TIM2ch3
- TIM1ch1
- FMP_I2C1
- USART1
- USART3
- (near R51) SPI1
- (near R51) FT
- SPI1
- BOOT1
- (near U27) EEPROM storage
- Remember only 16 interrups
  0  EXT_IN0
  1  EXT_IN1
  2  EXT_IN2
  3  PRU_RESET
  4  DOOR
  5  X_LIM
  6  A_LIM
  7  PROBE
  8  FD/HLD
  9  YLIM
  10  KPSTR
  11 CYC/ST
  12  HALT
  13  Z_LIM
  14  B_LIM
  15 JOG_SW ** Can't move
- STM32F411 MCU
- SHEET
- Expatria Technologies
- 1136 Glade Court
- Port Coquitlam, BC V3B 1R5
- PROJECT
- SIZE
- ENGR
- MODIFIED
- DOCUMENT
- REV
- Copyright Expatria Technologies 2022. This document describes Open Hardware and is licensed under the CERN-OHL-S v2. No warranty is implied or expressed.
- EMAIL: INFO@EXPATRIA.CA
- B
- /

### Library data of the parts
C9 C63 = 0603 1uF (105) 10% 50V: Chip capacitors; Manufacturer: Samsung Electro-Mechanics; PartNumber: CL10A105KB8NNNC; Tolerance: 10%; Voltage: 50V; Package: 0603; Supplier: LC; SuppliersPartNumber: C15849; Capacitance: 1uF; ComponentLink1Description: Supplier link; ComponentLink1URL: http://www.szlcsc.com/product/details_16531.html
C44 C57 C65-C71 = 0603 100nF (104) 10% 50V: Chip capacitors; Manufacturer: YAGEO; PartNumber: CC0603KRX7R9BB104; Tolerance: 10%; Voltage: 50V; ComponentLink1Description: Supplier link; ComponentLink1URL: http://www.szlcsc.com/product/details_15331.html; Package: 0603; Supplier: LC; SuppliersPartNumber: C14663; Capacitance: 100nF
C58 C59 = 1206 10uF (106) 10% 50V: Chip capacitors; Manufacturer: Samsung Electro-Mechanics; PartNumber: CL31A106KBHNNNE; Tolerance: 10%; Voltage: 50V; ComponentLink1Description: Supplier link; ComponentLink1URL: http://www.szlcsc.com/product/details_14236.html; Package: 1206; Supplier: LC; SuppliersPartNumber: C13585; Capacitance: 10uF; Manufacturer 1: Samsung Electro-Mechanics
C61 C75 = 0603 4.7uF (475) 10% 16V: Chip capacitors; Manufacturer: Samsung Electro-Mechanics; PartNumber: CL10A475KO8NNNC; Tolerance: 10%; Voltage: 16V; ComponentLink1Description: Supplier link; ComponentLink1URL: http://www.szlcsc.com/product/details_20375.html; Package: 0603; Supplier: LC; SuppliersPartNumber: C19666; Capacitance: 4.7uF
C72 C73 = 0603 10pF (100) 5% 50V: Chip capacitors; Manufacturer: Samsung Electro-Mechanics; PartNumber: CL10C100JB8NNNC; Tolerance: 5%; Voltage: 50V; ComponentLink1Description: Supplier link; ComponentLink1URL: http://www.szlcsc.com/product/details_1986.html; Package: 0603; Supplier: LC; SuppliersPartNumber: C1634; Capacitance: 10pF
D12 = 0603 LED Red: LED; ComponentLink1Description: 供应商链接; ComponentLink1URL: http://www.szlcsc.com/product/details_2659.html; Package: 0603; Supplier: LC; SuppliersPartNumber: C2286; Color: Red
D15 = 0603 LED Green: LED; ComponentLink1Description: 供应商链接; ComponentLink1URL: http://www.szlcsc.com/product/details_73152.html; Package: 0603; Supplier: LC; SuppliersPartNumber: C72043; Color: Green
J10 J11 = 2waySolderNO: ComponentLink1URL: http://www.edatools.cz/addons; ComponentLink1Description: Source
P8 = Header 2X2H: Header, 2-Pin, Dual row, Right Angle; LatestRevisionDate: 17-Jul-2002; LatestRevisionNote: Re-released for DXP Platform.; Publisher: Altium Limited; SuppliersPartNumber: C66690
P18 = CMP-1502-00948-1: THT Vertical Pin Header WR-PHD, Pitch 1.27 mm, Dual Row, 10 pins; Manufacturer: Wurth Elektronik; Rated Current: 1A; Pin Number: 10; Working Voltage: 100VAC; Contact Resistance: 20mOhm; Withstanding Voltage: 500VAC; Pitch: 1.27mm; Gender: Male; Mounting Technology: THT; Manufacturer URL: http://www.we-online.de; Package Reference: 62201021121; Row Number: Dual; Datasheet URL: https://katalog.we-online.de/em/datasheet/62201021121.pdf; Publisher: WurthElektronik; Packaging: Box; Operating Temperature: -40to105degC; Orientation: Vertical; Part Number: 62201021121
R17 R58 R71 R72 R83 = 0603 22R (22R0) 1%: Chip resistor; Manufacturer: Uniroyal Elec; PartNumber: 0603WAF220JT5E; Power: 1/10W; ComponentLink1Description: Supplier link; ComponentLink1URL: http://www.szlcsc.com/product/details_24078.html; Package: 0603; Supplier: LC; SuppliersPartNumber: C23345; Resistance: 22Ω; Tolerance: 1%
R39 R40 = 0603 2K (2001) 1%: Chip resistor; Manufacturer: Uniroyal Elec; PartNumber: 0603WAF2001T5E; Power: 1/10W; ComponentLink1Description: Supplier link; ComponentLink1URL: http://www.szlcsc.com/product/details_23702.html; Package: 0603; Supplier: LC; SuppliersPartNumber: C22975; Resistance: 2KΩ; Tolerance: 1%
R42 R63 R64 = 0603 4.7K (4701) 1%: Chip resistor; Manufacturer: Uniroyal Elec; PartNumber: 0603WAF4701T5E; Power: 1/10W; ComponentLink1Description: Supplier link; ComponentLink1URL: http://www.szlcsc.com/product/details_23889.html; Package: 0603; Supplier: LC; SuppliersPartNumber: C23162; Resistance: 4.7KΩ; Tolerance: 1%
R51 R62 R67 = 0603 10K (1002) 1%: Chip resistor; Manufacturer: Uniroyal Elec; PartNumber: 0603WAF1002T5E; Power: 1/10W; ComponentLink1Description: Supplier link; ComponentLink1URL: http://www.szlcsc.com/product/details_26547.html; Package: 0603; Supplier: LC; SuppliersPartNumber: C25804; Resistance: 10KΩ; Tolerance: 1%
SW3 SW4 = CMP-2000-07073-2: Side Push Type, 250 V, -40 to 90 degC, 3-Pin SMD, RoHS, Tape and Reel; Manufacturer: ALPS; Operating Force: 1.6N; Folder: Unified Components\Components\New Releases\New\; Maximum Current Rating: 0.05@12VDCA; RevisionId: 1; Pole Throw Configuration: SPST; Switch Configuration: N.O.; AccessRights: 2147483647; Maximum DC Voltage Rating: 12V; ContentType: Unified Component; Rad Hard: No; Mounting: SurfaceMount; Datasheet URL: http://www.alps.com/prod/info/E/PDF/Tact/SurfaceMount/SKRT/SKRT.PDF; Manufacturer URL: http://www.alps.com/e/; ReleaseDate: 22/09/2017 06:13:25 AM; ItemHRID: CMP-2000-07073; ContentTypeGUID: CB3C11C4-E317-11DF-B822-12313F0024A2; LifeCycle: Released; ItemGUID: EAC55BEC-37DC-4BDB-8BA7-D75E6D5C3D75; Packaging: Tape&Reel; Package Reference: SKRTLAE010; FolderGUID: B7F4506A-9127-42E7-A087-46FE7B18D116; Datasheet Version: 06/2015; Mounting Technology: SurfaceMount; LifeCycleStateGUID: 61E382EE-6656-4F12-9E24-BE9327104A25; Package Description: 3-Pin Surface Mount Device, Body 4.5 x 3.55 mm, Pitch 1.225 mm; SuppliersPartNumber: C110293; Manufacturer 1: ALPS
U22 = STM32F446RET6: IC MCU 32BIT 512KB FLASH 64LQFP; Manufacturer: STMicroelectronics; Number Of Spi Channels: 4; Ram Size: 128KBytes; Standoff Height: 0.05mm; Number Of Uart Channels: 6; Number Of Pwm Channels: 32; Max Junction Temp: +105°C; Number Of I/Os: 50; Number Of Usb Channels: 2; Frequency: 180MHz; Number Of A/D Converters: 3; Max Supply Voltage: 3.6V; Number Of Adc Channels: 16; Interface: I2C,SPI,UART,USART,CAN,USB,LIN,IrDA,I2S,Other; Memory Size: 512KBytes; Number Of Timers/Counters: 14; Min Supply Voltage: 1.7V; Core Architecture: ARM Cortex-M4; Data Bus Width: 32bits; Number Of Cores: 1; Consigned: Y; Ambient Temperature Range Low: -40°C; ComponentLink2URL: https://www.st.com/en/microcontrollers-microprocessors/stm32f446re.html; Category: IC; Height: 1.6mm; Ipc Land Pattern Name: QFP50P1200X1200X160-64; Octopart: https://octopart.com/stm32f446ret6-stmicroelectronics-52642920; Temperature Range High: +105°C; Lead Free: Yes; Mouser Description: ARM Microcontrollers - MCU High-performance and DSP with FP, ARM Cortex-M4 MCU with 512 Kbytes Flash, 180 MHz CPU, Art Accelerator, SDRAM; Digikey Description: IC MCU 32BIT 512KB FLASH 64LQFP; Ambient Temperature Range High: +85°C; Number Of I2C Channels: 4; Memory Type: FLASH; RoHS: TRUE; Automotive: No; Device Class L1: Integrated Circuits (ICs); Temperature: -40°C to +105°C; Device Class L2: Embedded Processors and Controllers; Device Class L3: Microcontrollers; Temperature Range Low: -40°C; Package: LQFP64-5W; ComponentLink2Description: Datasheet; Manufacturer 1: STMicroelectronics; Manufacturer Part Number 1: STM32F446RET6; SuppliersPartNumber: C69336
U27 = CMP-0159-00216-1: IC EEPROM 128KBIT I2C 8SOIC; SuppliersPartNumber: C918271
VR4 = SOT-223 AMS1117-3.3: Vout=3.3V 1A 72dB@(120Hz) (LDO); Manufacturer 1: AMS; ComponentLink1Description: 供应商链接; ComponentLink1URL: http://www.szlcsc.com/product/details_6652.html; Package: SOT-223; Supplier: LC; SuppliersPartNumber: C6186; Manufacturer Part Number 1: AMS1117-3.3
Y2 = YSX321SL: Crystal or Oscillator; Manufacturer_Name: Yangxing Tech; Manufacturer_Part_Number: X322525MSB4SI; Height: 0.8mm; SuppliersPartNumber: C13740

## Sheet Spindle_Sync.SchDoc: STM32F446 CNC
size B; Author: AM; CompanyName: Expatria Technologies; DrawnBy: A.Marles; Engineer: AM; Organization: Expatria Technolgoies; DocumentNumber: 11; Revision: A1; SheetNumber: 11; SheetTotal: 14
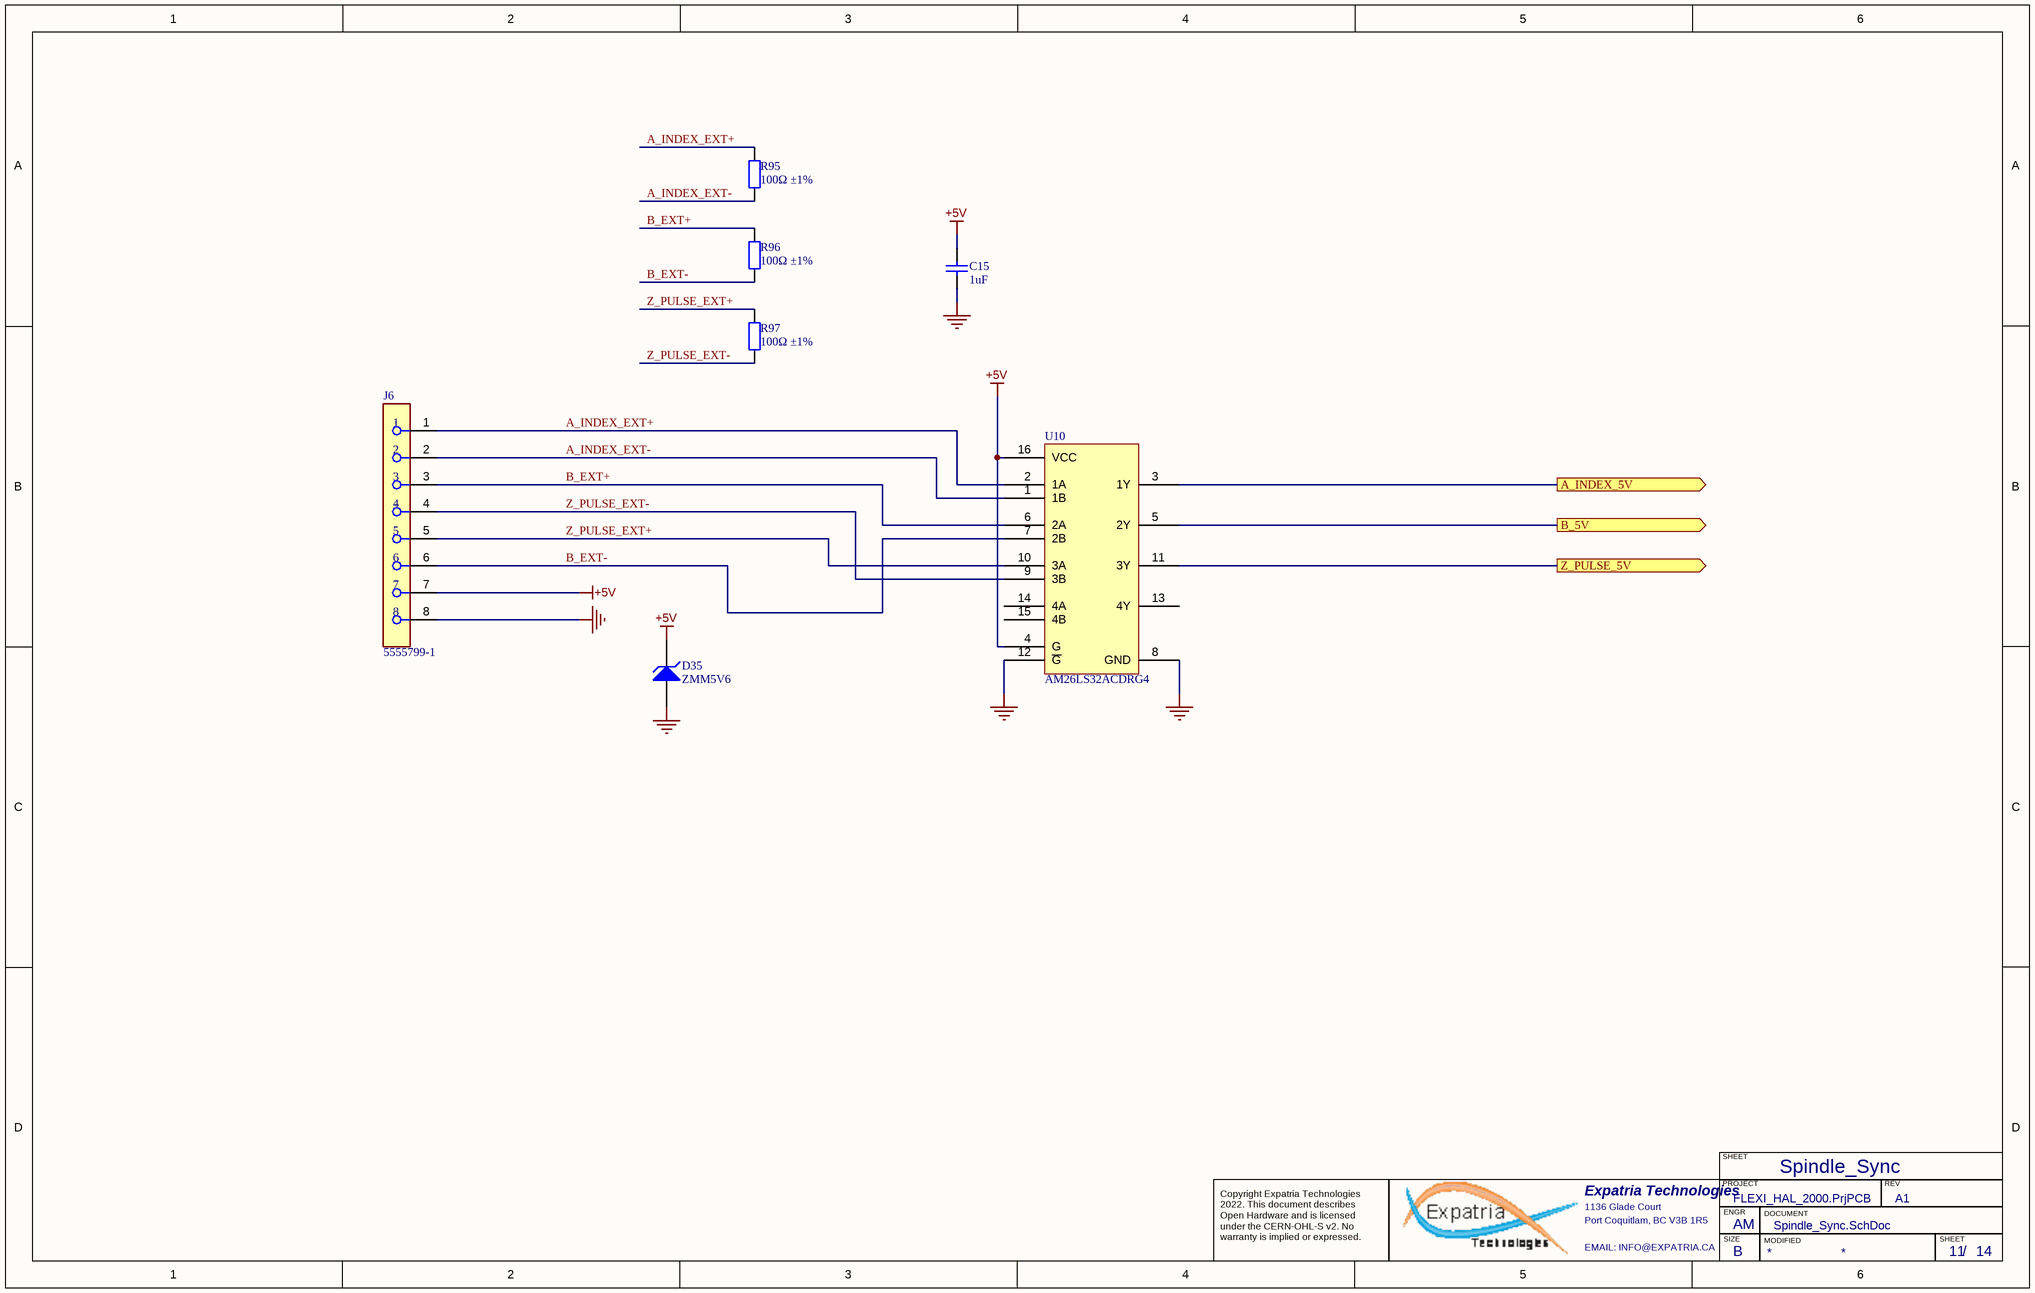
[diagram p12: Spindle_Sync.SchDoc]

### Parts
C15  1uF  [0603_C]
D35  ZMM5V6  [LL-34]
J6  5555799-1  [FP-5555799-1-MFG]
R95  100Ω ±1%  [0603_R]
R96  100Ω ±1%  [0603_R]
R97  100Ω ±1%  [0603_R]
U10  AM26LS32ACDRG4  [SOIC-16_150mil]

### Ports
A_INDEX_5V (out), B_5V (out), Z_PULSE_5V (out)

### Nets
+5V: C15.2 D35.2(K) J6.7 U10.4(G) U10.16(VCC)
GND: C15.1 D35.1(A) J6.8 U10.8(GND) U10.12(~{G})
A_INDEX_EXT+: J6.1 R95.2 U10.2(1A)
A_INDEX_EXT-: J6.2 R95.1 U10.1(1B)
B_EXT+: J6.3 R96.2 U10.6(2A)
B_EXT-: J6.6 R96.1 U10.7(2B)
EXT_IN0: U10.3(1Y) ; port A_INDEX_5V
EXT_IN1: U10.5(2Y) ; port B_5V
EXT_IN2: U10.11(3Y) ; port Z_PULSE_5V
Z_PULSE_EXT+: J6.5 R97.2 U10.10(3A)
Z_PULSE_EXT-: J6.4 R97.1 U10.9(3B)

Not connected (* = marked no-connect by the designer): U10 13(4Y) 14(4A) 15(4B)

### Notes on the sheet
- Spindle_Sync
- SHEET
- Expatria Technologies
- 1136 Glade Court
- Port Coquitlam, BC V3B 1R5
- PROJECT
- SIZE
- ENGR
- MODIFIED
- DOCUMENT
- REV
- Copyright Expatria Technologies 2022. This document describes Open Hardware and is licensed under the CERN-OHL-S v2. No warranty is implied or expressed.
- EMAIL: INFO@EXPATRIA.CA
- B
- /

### Library data of the parts
C15 = 0603 1uF (105) 10% 50V: as C9 on sheet MCU_STM32F446RE; ComponentLink1Description: Supplier link; ComponentLink1URL: http://www.szlcsc.com/product/details_16531.html; Package: 0603; Supplier: LC; SuppliersPartNumber: C15849; Capacitance: 1uF
D35 = LL-34 ZMM5V6: 500mW - 0.1uA @ 1V 5.6V LL-34 Zener Diodes ROHS; ComponentLink1Description: 供应商链接; ComponentLink1URL: http://www.szlcsc.com/product/details_8541.html; Package: LL-34; Supplier: LC; SuppliersPartNumber: C8062
J6 = CMP-03371-000003-1: CONN MOD JACK 8P8C VERT UNSHLD; Manufacturer: TE Connectivity; Pitch: 2.54mm; Number Of Contacts: 8; Is Female: yes; Device Class L3: unset; Temperature Range High: +85°C; Temperature Range Low: -40°C; Octopart: https://octopart.com/5555799-1-te+connectivity-39526335; Device Class L1: Connectors; Device Class L2: Modular / Ethernet Connectors; Mouser Description: Conn RJ-45 F 8 POS 2.54mm Solder ST Thru-Hole 8 Terminal 1 Port Cat 3 Box/Package/Tray; Digikey Description: CONN MOD JACK 8P8C VERT UNSHLD; Package: 5555799-1; Temperature: -40°C to +85°C; SuppliersPartNumber: C305983; Manufacturer 1: TE Connectivity; Manufacturer Part Number 1: 5555799-1
R95-R97 = 0603 100R (1000) 1%: Chip resistor; Manufacturer: Uniroyal Elec; PartNumber: 0603WAF1000T5E; Power: 1/10W; ComponentLink1Description: Supplier link; ComponentLink1URL: http://www.szlcsc.com/product/details_23502.html; Package: 0603; Supplier: LC; SuppliersPartNumber: C22775; Resistance: 100Ω; Tolerance: 1%
U10 = AM26LS32ACDRG4_[C6180]: RS-422 Interface IC Quad Diff Line Rcvr; ComponentLink1Description: 供应商链接; ComponentLink1URL: http://www.szlcsc.com/product/details_6646.html; Package: SOIC-16_150mil; Supplier: LC; SuppliersPartNumber: C6180

## Sheet 5V_Power_Supply.SchDoc: STM32F446 CNC
size B; Author: AM; CompanyName: Expatria Technologies; DrawnBy: A.Marles; Engineer: AM; Organization: Expatria Technolgoies; DocumentNumber: 9; Revision: A7; SheetNumber: 9; SheetTotal: 14
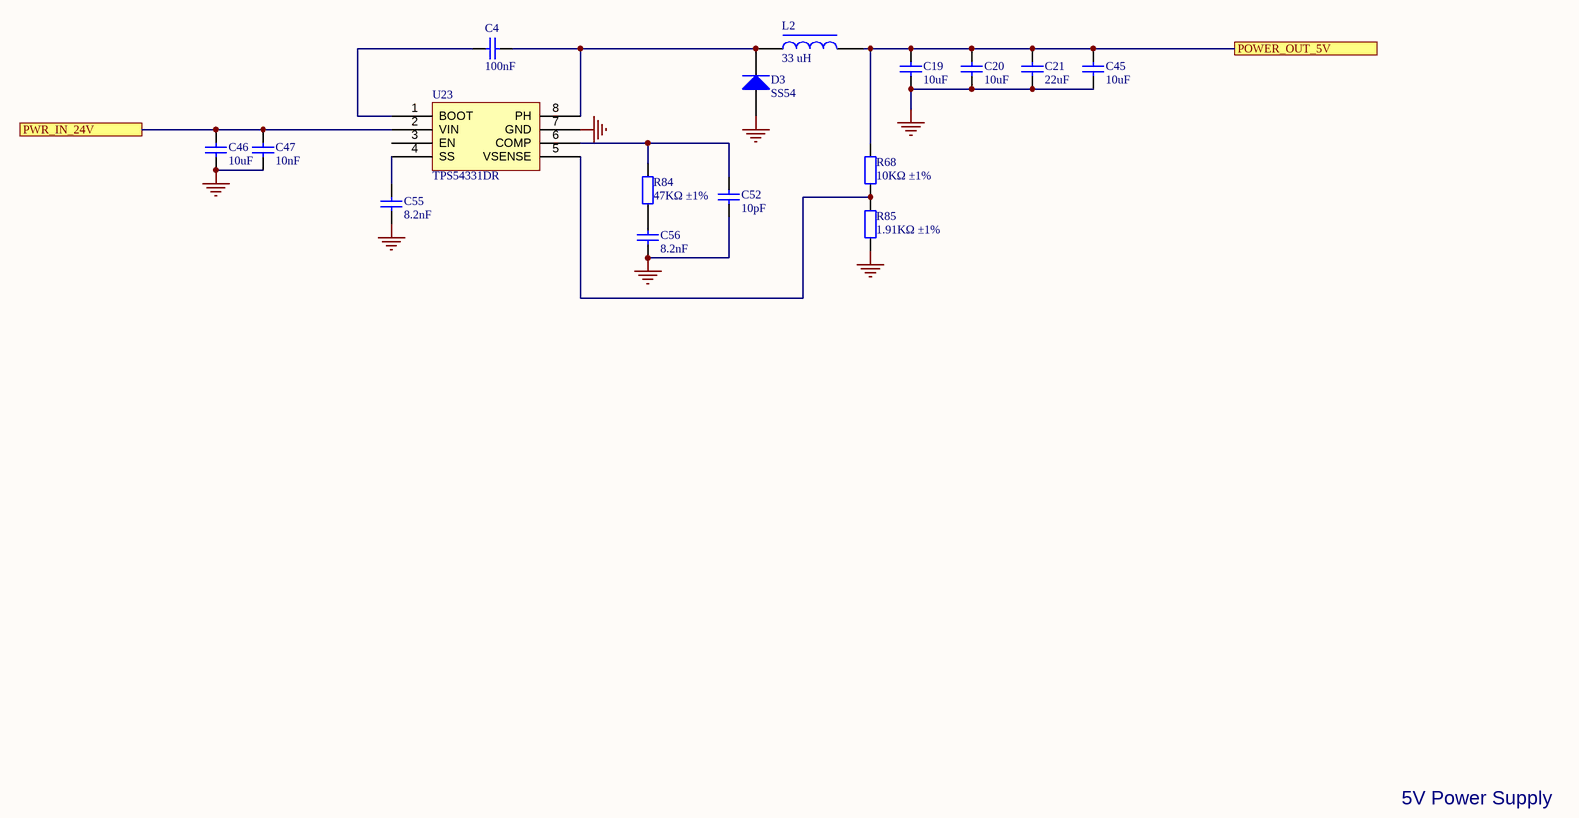
[diagram p13: 5V_Power_Supply.SchDoc]

### Parts
C4  100nF  [0603_C]
C19  10uF  [1206_C]
C20  10uF  [1206_C]
C21  22uF  [0805_C]
C45  10uF  [1206_C]
C46  10uF  [1206_C]
C47  10nF  [0603_C]
C52  10pF  [0603_C]
C55  8.2nF  [0603_C]
C56  8.2nF  [0603_C]
D3  SS54  [SMA(DO-214AC)_S1]
L2  33 uH  [INDPM7366X300N]
R68  10KΩ ±1%  [0603_R]
R84  47KΩ ±1%  [0603_R]
R85  1.91KΩ ±1%  [0603_R]
U23  TPS54331DR  [SOIC-8_150mil]

### Ports
POWER_OUT_5V, PWR_IN_24V

### Nets
+5V: C19.2 C20.2 C21.2 C45.2 L2.2 R68.2 ; port POWER_OUT_5V
+24V: C46.2 C47.2 U23.2(VIN) ; port PWR_IN_24V
GND: C19.1 C20.1 C21.1 C45.1 C46.1 C47.1 C52.1 C55.1 C56.1 D3.1(A) R85.1 U23.7(GND)
NetC4_1: C4.1 U23.1(BOOT)
NetC4_2: C4.2 D3.2(K) L2.1 U23.8(PH)
NetC52_2: C52.2 R84.2 U23.6(COMP)
NetC55_2: C55.2 U23.4(SS)
NetC56_2: C56.2 R84.1
NetR68_1: R68.1 R85.2 U23.5(VSENSE)

Not connected (* = marked no-connect by the designer): U23 3(EN)

### Notes on the sheet
- 5V Power Supply
- SHEET
- Expatria Technologies
- 1136 Glade Court
- Port Coquitlam, BC V3B 1R5
- PROJECT
- SIZE
- ENGR
- MODIFIED
- DOCUMENT
- REV
- Copyright Expatria Technologies 2022. This document describes Open Hardware and is licensed under the CERN-OHL-S v2. No warranty is implied or expressed.
- EMAIL: INFO@EXPATRIA.CA
- B
- /

### Library data of the parts
C4 = 0603 100nF (104) 10% 50V: as C44 on sheet MCU_STM32F446RE; Package: 0603; Supplier: LC; SuppliersPartNumber: C14663; Capacitance: 100nF; Manufacturer 1: YAGEO
C19 C20 C45 C46 = 1206 10uF (106) 10% 50V: as C58 on sheet MCU_STM32F446RE; Package: 1206; Supplier: LC; SuppliersPartNumber: C13585; Capacitance: 10uF
  C19 C20 C45: ComponentLink1Description: Supplier link; ComponentLink1URL: http://www.szlcsc.com/product/details_14236.html
  C46: Manufacturer 1: Samsung Electro-Mechanics
C21 = 0805 22uF (226) 20% 25V: Chip capacitors; Manufacturer: Samsung Electro-Mechanics; PartNumber: CL21A226MAQNNNE; Tolerance: 20%; Voltage: 25V; Package: 0805; Supplier: LC; SuppliersPartNumber: C2922481; Capacitance: 22uF; ComponentLink1Description: Supplier link; ComponentLink1URL: http://www.szlcsc.com/product/details_46786.html
C47 = 0603 10nF (103) 10% 50V: Chip capacitors; Manufacturer: Guangdong Fenghua Advanced Tech; PartNumber: 0603B103K500NT; Tolerance: 10%; Voltage: 50V; Package: 0603; Supplier: LC; SuppliersPartNumber: C57112; Capacitance: 10nF; ComponentLink1Description: Supplier link; ComponentLink1URL: http://www.szlcsc.com/product/details_58143.html
C52 = 0603 10pF (100) 5% 50V: as C72 on sheet MCU_STM32F446RE; Package: 0603; Supplier: LC; SuppliersPartNumber: C1634; Capacitance: 10pF; ComponentLink1Description: Supplier link; ComponentLink1URL: http://www.szlcsc.com/product/details_1986.html
C55 C56 = 0603 8.2nF (822) 10% 50V: Chip capacitors; Manufacturer: Samsung Electro-Mechanics; PartNumber: CL10B822KB8NNNC; Tolerance: 10%; Voltage: 50V; Package: 0603; Supplier: LC; SuppliersPartNumber: C27920; Capacitance: 8.2nF
  C55: Manufacturer 1: Samsung Electro-Mechanics
  C56: ComponentLink1Description: Supplier link; ComponentLink1URL: http://www.szlcsc.com/product/details_28670.html
D3 = SMA(DO-214AC) SS54: 40V 5A 550mV@5A; Manufacturer 1: MDD; Package: SMA(DO-214AC); Supplier: LC; SuppliersPartNumber: C22452; Manufacturer Part Number 1: SS54
L2 = 1206 10uH 10%: 33uH ±20% 2A 270mΩ SMD,6.6x7.3x3.0mm Power Inductors RoHS; Package: SMD_6.6x7.3x3.0mm; Supplier: JLCPCB; SuppliersPartNumber: C329385
R68 = 0603 10K (1002) 1%: as R51 on sheet MCU_STM32F446RE; Package: 0603; Supplier: LC; SuppliersPartNumber: C25804; Resistance: 10KΩ; Tolerance: 1%; ComponentLink1Description: Supplier link; ComponentLink1URL: http://www.szlcsc.com/product/details_26547.html
R84 = 0603 47K (4702) 1%: Chip resistor; Manufacturer: Uniroyal Elec; PartNumber: 0603WAF4702T5E; Power: 1/10W; Package: 0603; Supplier: LC; SuppliersPartNumber: C25819; Resistance: 47KΩ; Tolerance: 1%; ComponentLink1Description: Supplier link; ComponentLink1URL: http://www.szlcsc.com/product/details_26562.html
R85 = 0603 2K (2001) 1%: Chip resistor; Manufacturer: Uniroyal Elec; PartNumber: 0603WAF1911T5E; Power: 1/10W; Package: 0603; Supplier: LC; SuppliersPartNumber: C22853; Resistance: 1.91KΩ; Tolerance: 1%; ComponentLink1Description: Supplier link; ComponentLink1URL: http://www.szlcsc.com/product/details_23702.html
U23 = TPS54331DR_[C9865]: Switching Voltage Regulators 3A 28V In Step Down SWIFT DC/DC Cnvrtr; Package: SOIC-8_150mil; Supplier: LC; SuppliersPartNumber: C9865

## Sheet Aux_Outputs.SchDoc: RP2040 CNC
size B; Author: AM; CompanyName: Expatria Technologies; DrawnBy: A.Marles; Engineer: AM; Organization: Expatria Technolgoies; DocumentNumber: 10; Revision: A7; SheetNumber: 10; SheetTotal: 14
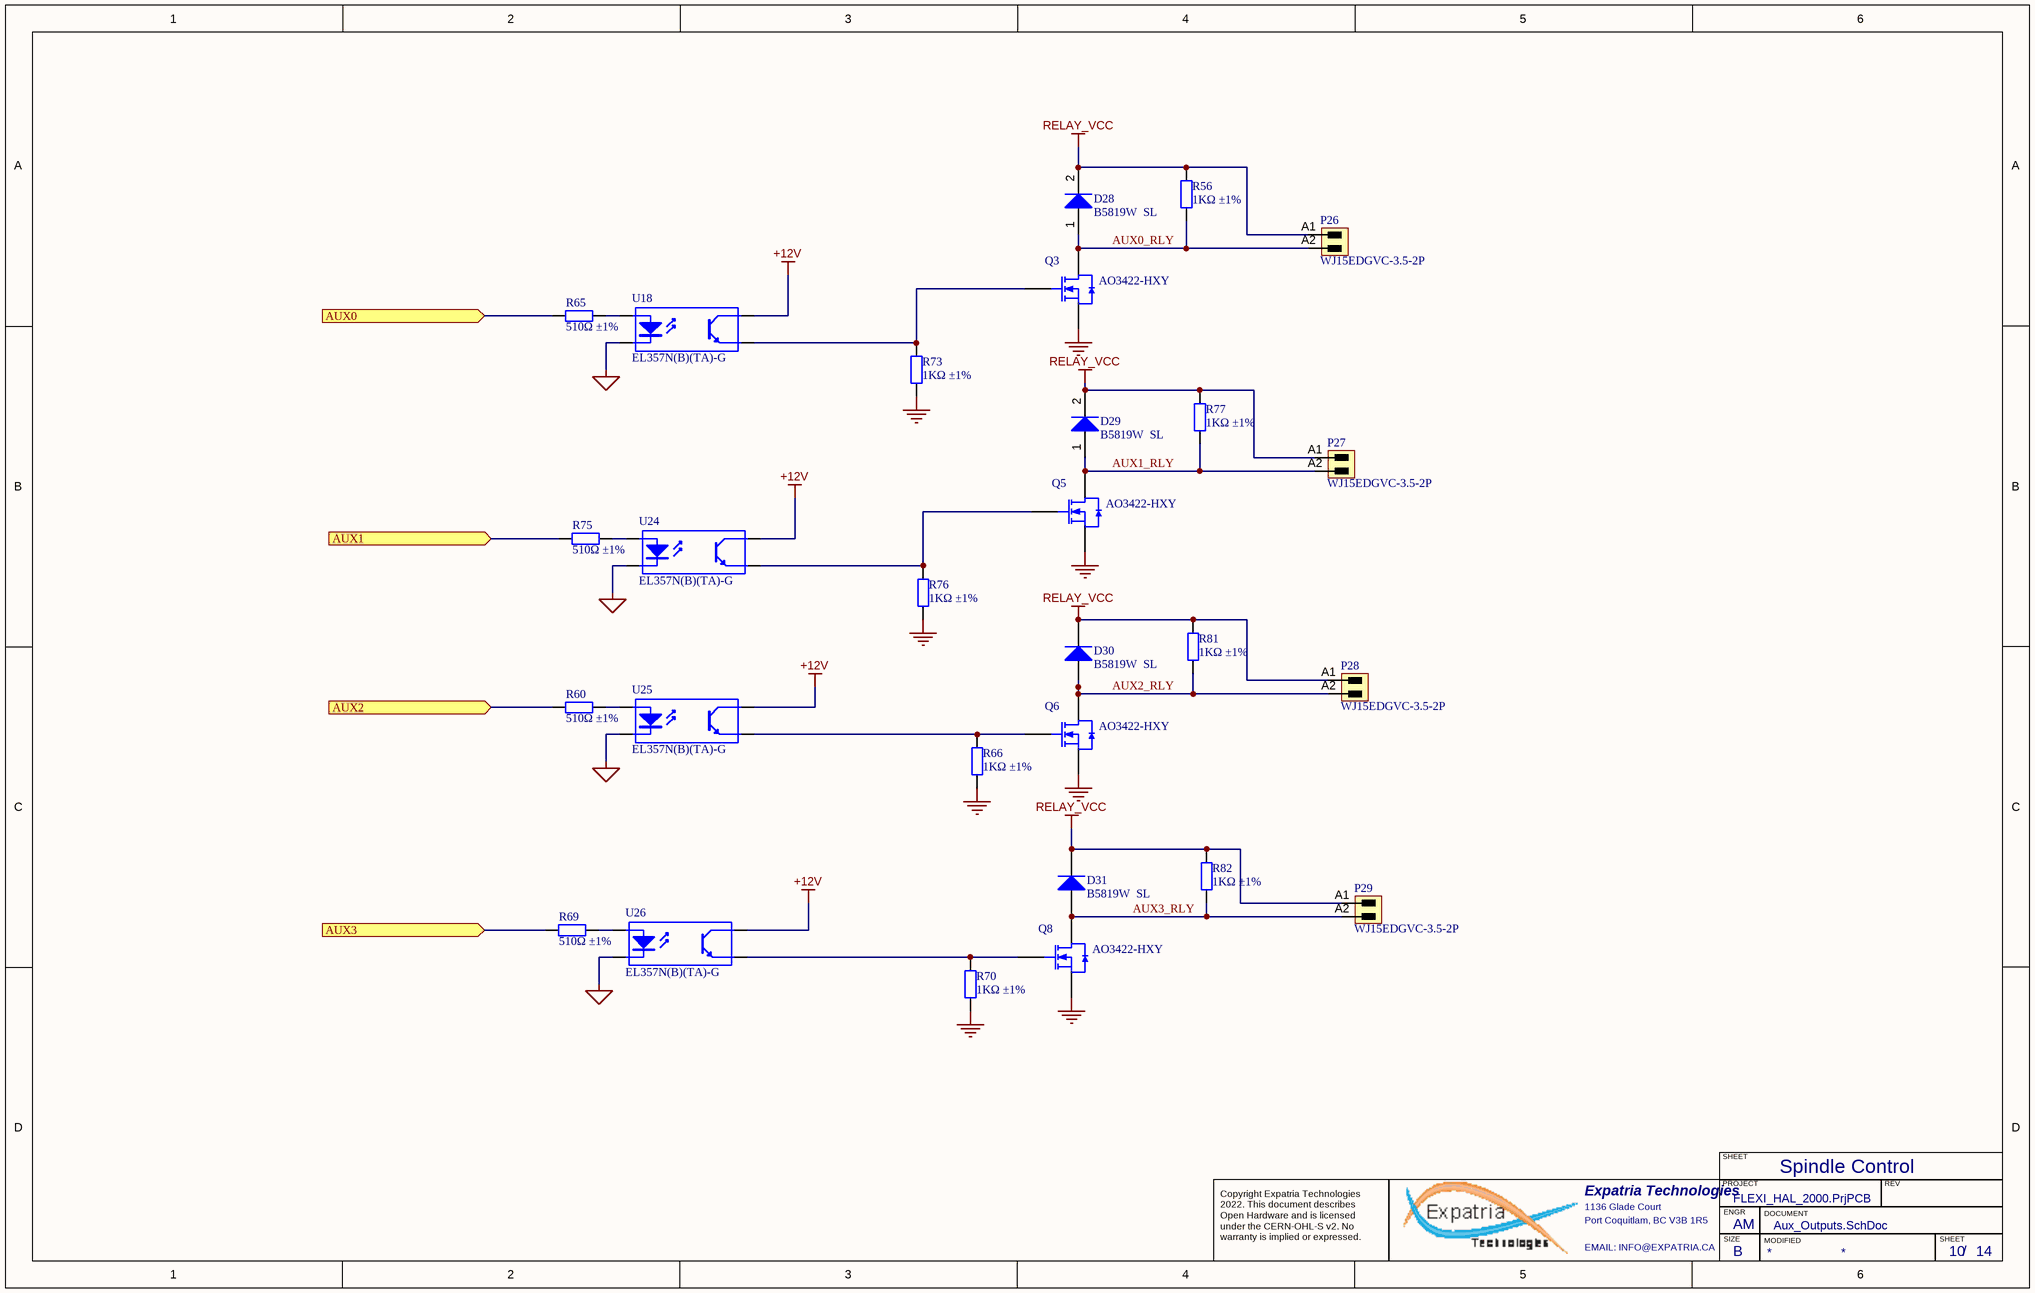
[diagram p14: Aux_Outputs.SchDoc]

### Parts
D28  B5819W  SL  [SOD-123]
D29  B5819W  SL  [SOD-123]
D30  B5819W  SL  [SOD-123]
D31  B5819W  SL  [SOD-123]
P26  WJ15EDGVC-3.5-2P  [691321100002]
P27  WJ15EDGVC-3.5-2P  [691321100002]
P28  WJ15EDGVC-3.5-2P  [691321100002]
P29  WJ15EDGVC-3.5-2P  [691321100002]
Q3  AO3422-HXY  [SOT-23-3L]
Q5  AO3422-HXY  [SOT-23-3L]
Q6  AO3422-HXY  [SOT-23-3L]
Q8  AO3422-HXY  [SOT-23-3L]
R56  1KΩ ±1%  [0603_R]
R60  510Ω ±1%  [0603_R]
R65  510Ω ±1%  [0603_R]
R66  1KΩ ±1%  [0603_R]
R69  510Ω ±1%  [0603_R]
R70  1KΩ ±1%  [0603_R]
R73  1KΩ ±1%  [0603_R]
R75  510Ω ±1%  [0603_R]
R76  1KΩ ±1%  [0603_R]
R77  1KΩ ±1%  [0603_R]
R81  1KΩ ±1%  [0603_R]
R82  1KΩ ±1%  [0603_R]
U18  EL357N(B)(TA)-G  [SOP-4_P2.54]
U24  EL357N(B)(TA)-G  [SOP-4_P2.54]
U25  EL357N(B)(TA)-G  [SOP-4_P2.54]
U26  EL357N(B)(TA)-G  [SOP-4_P2.54]

### Ports
AUX0 (in), AUX1 (in), AUX2 (in), AUX3 (in)

### Nets
+12V: U18.4(C) U24.4(C) U25.4(C) U26.4(C)
GND: Q3.2(S) Q5.2(S) Q6.2(S) Q8.2(S) R66.1 R70.1 R73.1 R76.1
MCU_GND: U18.2(K) U24.2(K) U25.2(K) U26.2(K)
RELAY_VCC: D28.2(K) D29.2(K) D30.2(K) D31.2(K) P26.A1 P27.A1 P28.A1 P29.A1 R56.2 R77.2 R81.2 R82.2
AUX0_RLY: D28.1(A) P26.A2 Q3.3(D) R56.1
AUX1_RLY: D29.1(A) P27.A2 Q5.3(D) R77.1
AUX2_RLY: D30.1(A) P28.A2 Q6.3(D) R81.1
AUX3_RLY: D31.1(A) P29.A2 Q8.3(D) R82.1
AUXOUT_0: R65.1 ; port AUX0
AUXOUT_1: R75.1 ; port AUX1
AUXOUT_2: R60.1 ; port AUX2
AUXOUT_3: R69.1 ; port AUX3
NetQ3_1: Q3.1(G) R73.2 U18.3(E)
NetQ5_1: Q5.1(G) R76.2 U24.3(E)
NetQ6_1: Q6.1(G) R66.2 U25.3(E)
NetQ8_1: Q8.1(G) R70.2 U26.3(E)
NetR60_2: R60.2 U25.1(A)
NetR65_2: R65.2 U18.1(A)
NetR69_2: R69.2 U26.1(A)
NetR75_2: R75.2 U24.1(A)

### Notes on the sheet
- Spindle Control
- SHEET
- Expatria Technologies
- 1136 Glade Court
- Port Coquitlam, BC V3B 1R5
- PROJECT
- SIZE
- ENGR
- MODIFIED
- DOCUMENT
- REV
- Copyright Expatria Technologies 2022. This document describes Open Hardware and is licensed under the CERN-OHL-S v2. No warranty is implied or expressed.
- EMAIL: INFO@EXPATRIA.CA
- B
- /

### Library data of the parts
D28-D31 = SOD-123 B5819W  SL: Schottky Diode; ComponentLink1Description: 供应商链接; ComponentLink1URL: http://www.szlcsc.com/product/details_9093.html; Package: SOD-123; Supplier: LC; SuppliersPartNumber: C8598
P26-P29 = 3.5mm Terminal Header 2p: Header,Male Pin,Covered(4 Sided) 2 1 0.138"（3.50mm） 2 P=3.5mm Pluggable System Terminal Block RoHS; Manufacturer: Weidmueller; Manufacturer 1: Weidmuller; Manufacturer Part Number 1: 1604470000; UL_94_flammability_rating: V-0; Pitch_mm: 3.5 mm; Side_termination_characteristic: closed side; Pitch_inch: 0.138 inch; Solder_pin_length_mm: 3.2 mm; Short_text_for_material: SL 3.50/02/180G 3.2SN OR BX; ComponentLink1Description: Manufacturer URL; ComponentLink1URL: http://www.weidmueller.com/; PartNumber: WJ15EDGVC-3.5-2P; Revision: V1; PackageReference: SL_3_50_180G_02; Packaging: Box; SuppliersPartNumber: C192777
Q3 Q5 Q6 Q8 = AO3400A N道沟 X0YV1T SOT-23: 60V 4.5A 8W 75mΩ@10V,5A 2.5V@250uA N Channel 695pF@15V SOT-23-3L MOSFETs ROHS; ComponentLink1Description: 供应商链接; ComponentLink1URL: http://www.szlcsc.com/product/details_21629.html; Package: SOT-23L; Supplier: LC; SuppliersPartNumber: C4748727
R56 R66 R70 R73 R76 R77 R81 R82 = 0603 1K (1001) 1%: Chip resistor; Manufacturer: Uniroyal Elec; PartNumber: 0603WAF1001T5E; Power: 1/10W; ComponentLink1Description: Supplier link; ComponentLink1URL: http://www.szlcsc.com/product/details_21904.html; Package: 0603; Supplier: LC; SuppliersPartNumber: C21190; Resistance: 1KΩ; Tolerance: 1%
R60 R65 R69 R75 = 0603 510R (5100) 1%: Chip resistor; Manufacturer: Uniroyal Elec; PartNumber: 0603WAF5100T5E; Power: 1/10W; ComponentLink1Description: Supplier link; ComponentLink1URL: http://www.szlcsc.com/product/details_23920.html; Package: 0603; Supplier: LC; SuppliersPartNumber: C23193; Resistance: 510Ω; Tolerance: 1%
U18 U24-U26 = EL357N(B)(TA)-G_[C6649]: Optocoupler SOP-4, EL357N(B)(TA)-G, Everlight Electronics; ComponentLink1Description: 供应商链接; ComponentLink1URL: http://www.szlcsc.com/product/details_7114.html; Package: SOP-4_P2.54; Supplier: LC; SuppliersPartNumber: C6649; Manufacturer 1: Everlight; Manufacturer Part Number 1: EL357N(B)(TA)-G